# EAGLE schematic AM3352-TI (EAGLE 9.6.2), part 1 of 2
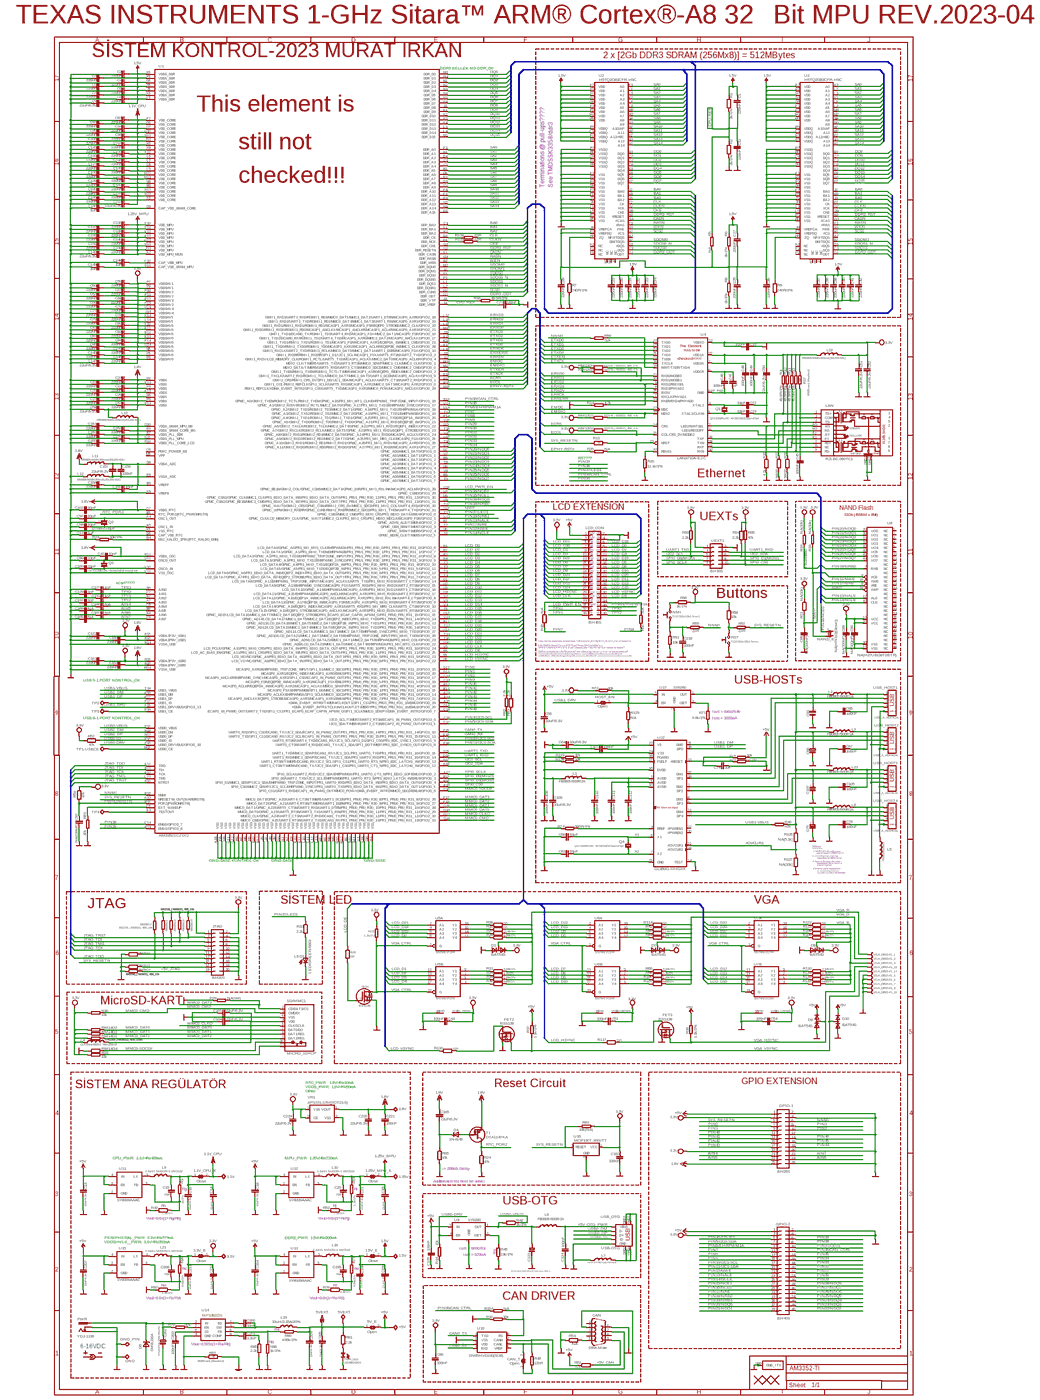
[diagram p0: schematic, sheet 1, overview]
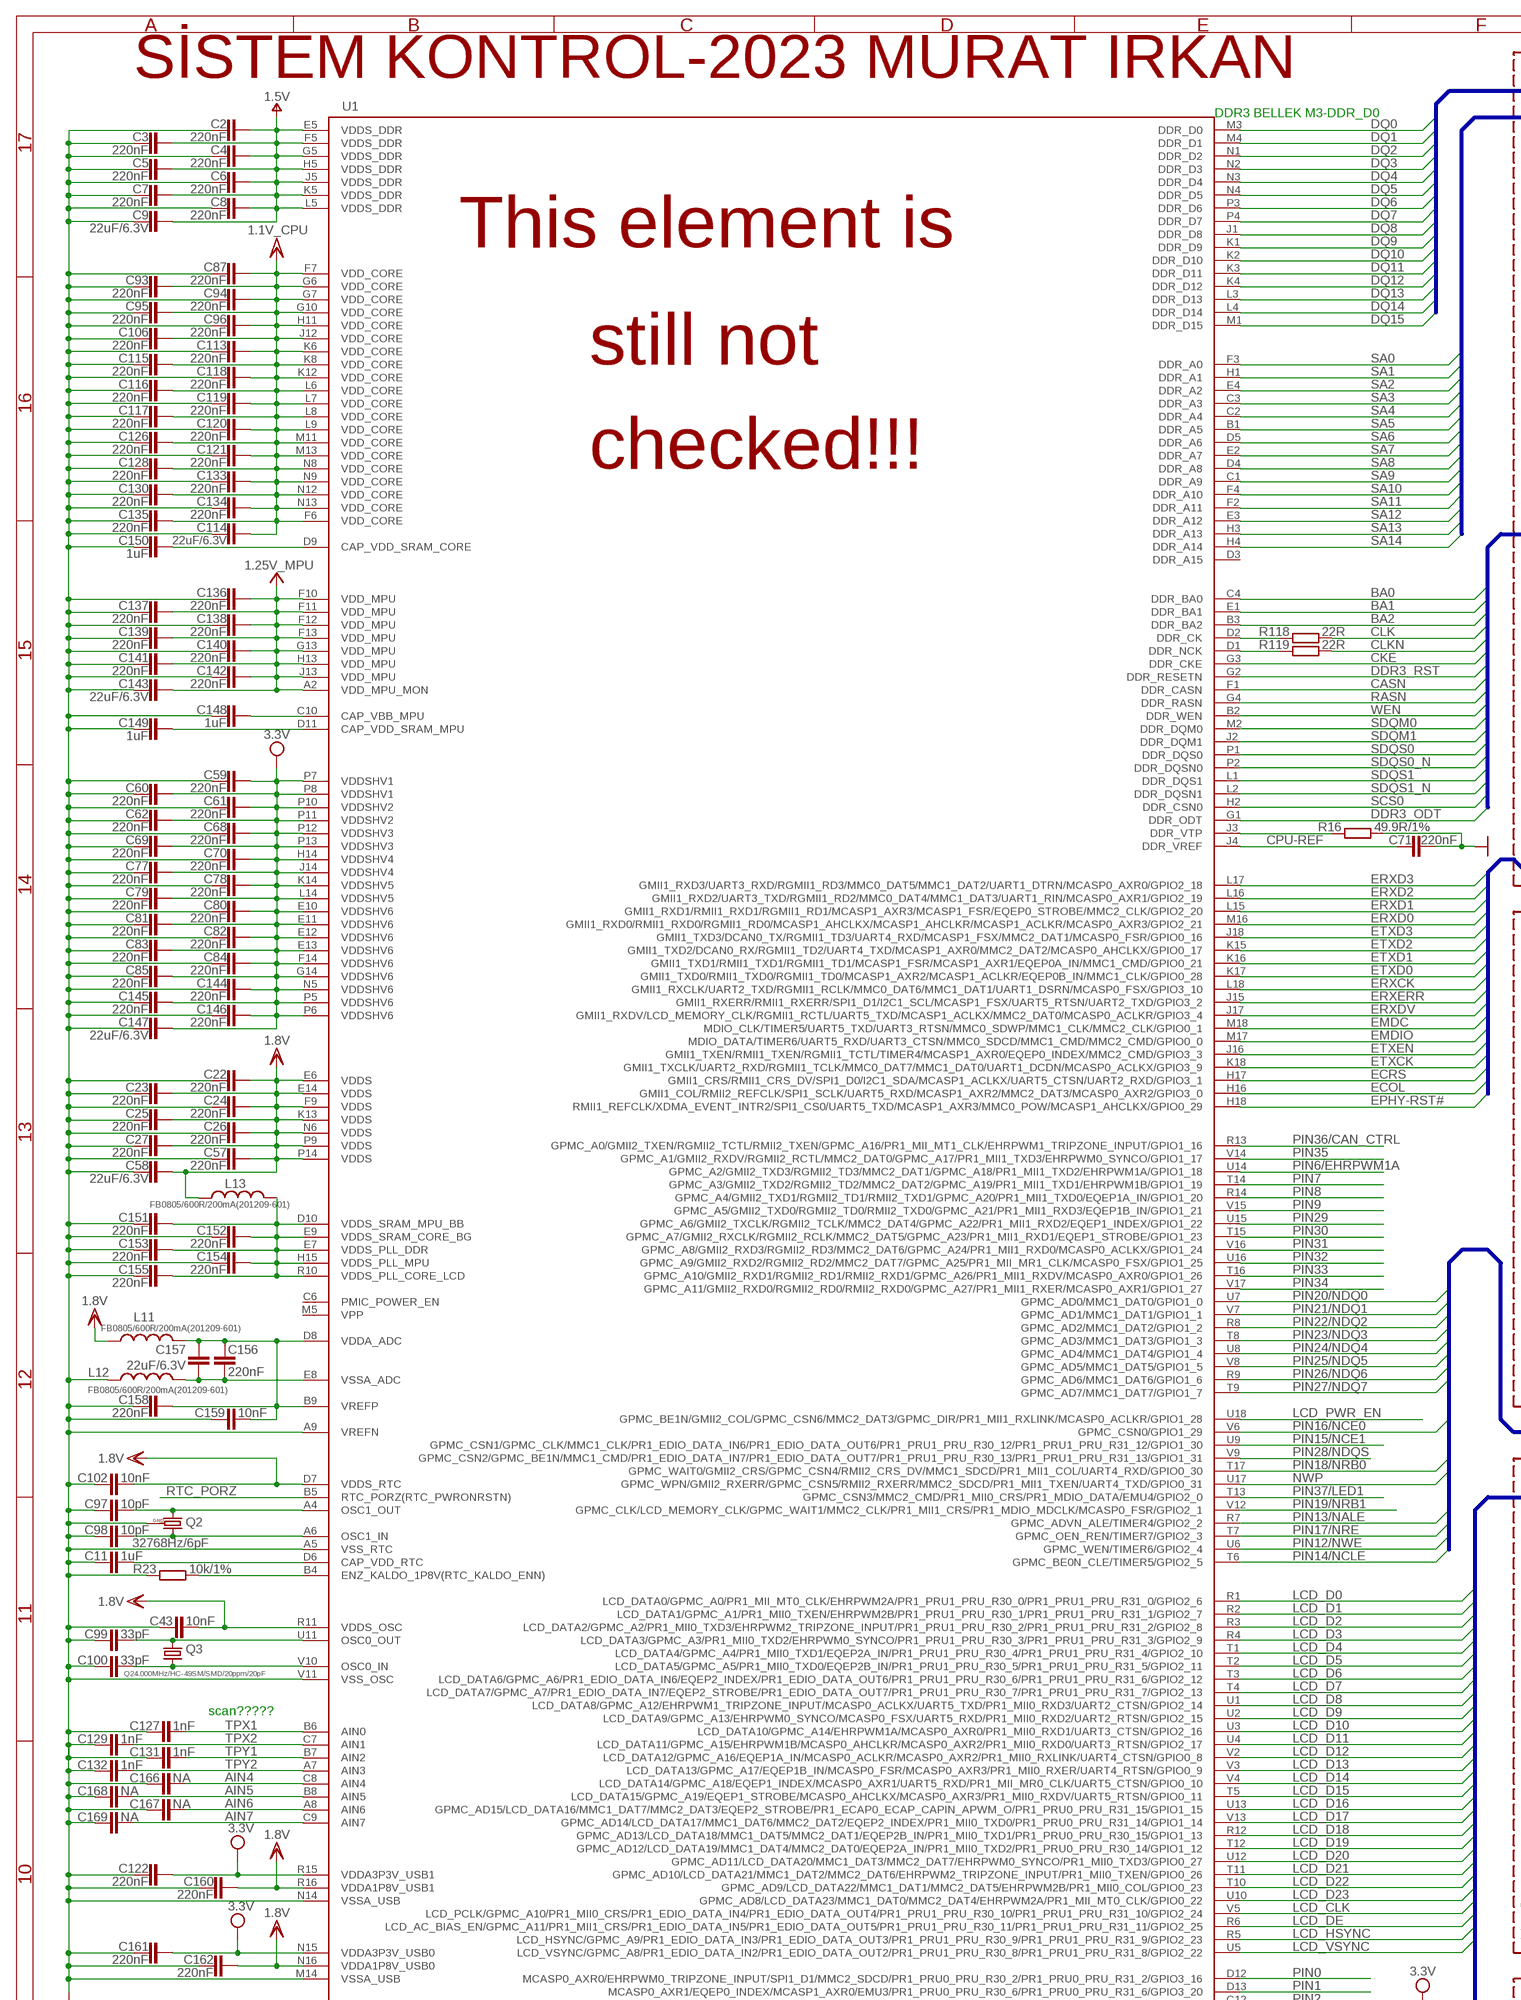
[diagram p1: schematic, sheet 1, part 1 of 4]
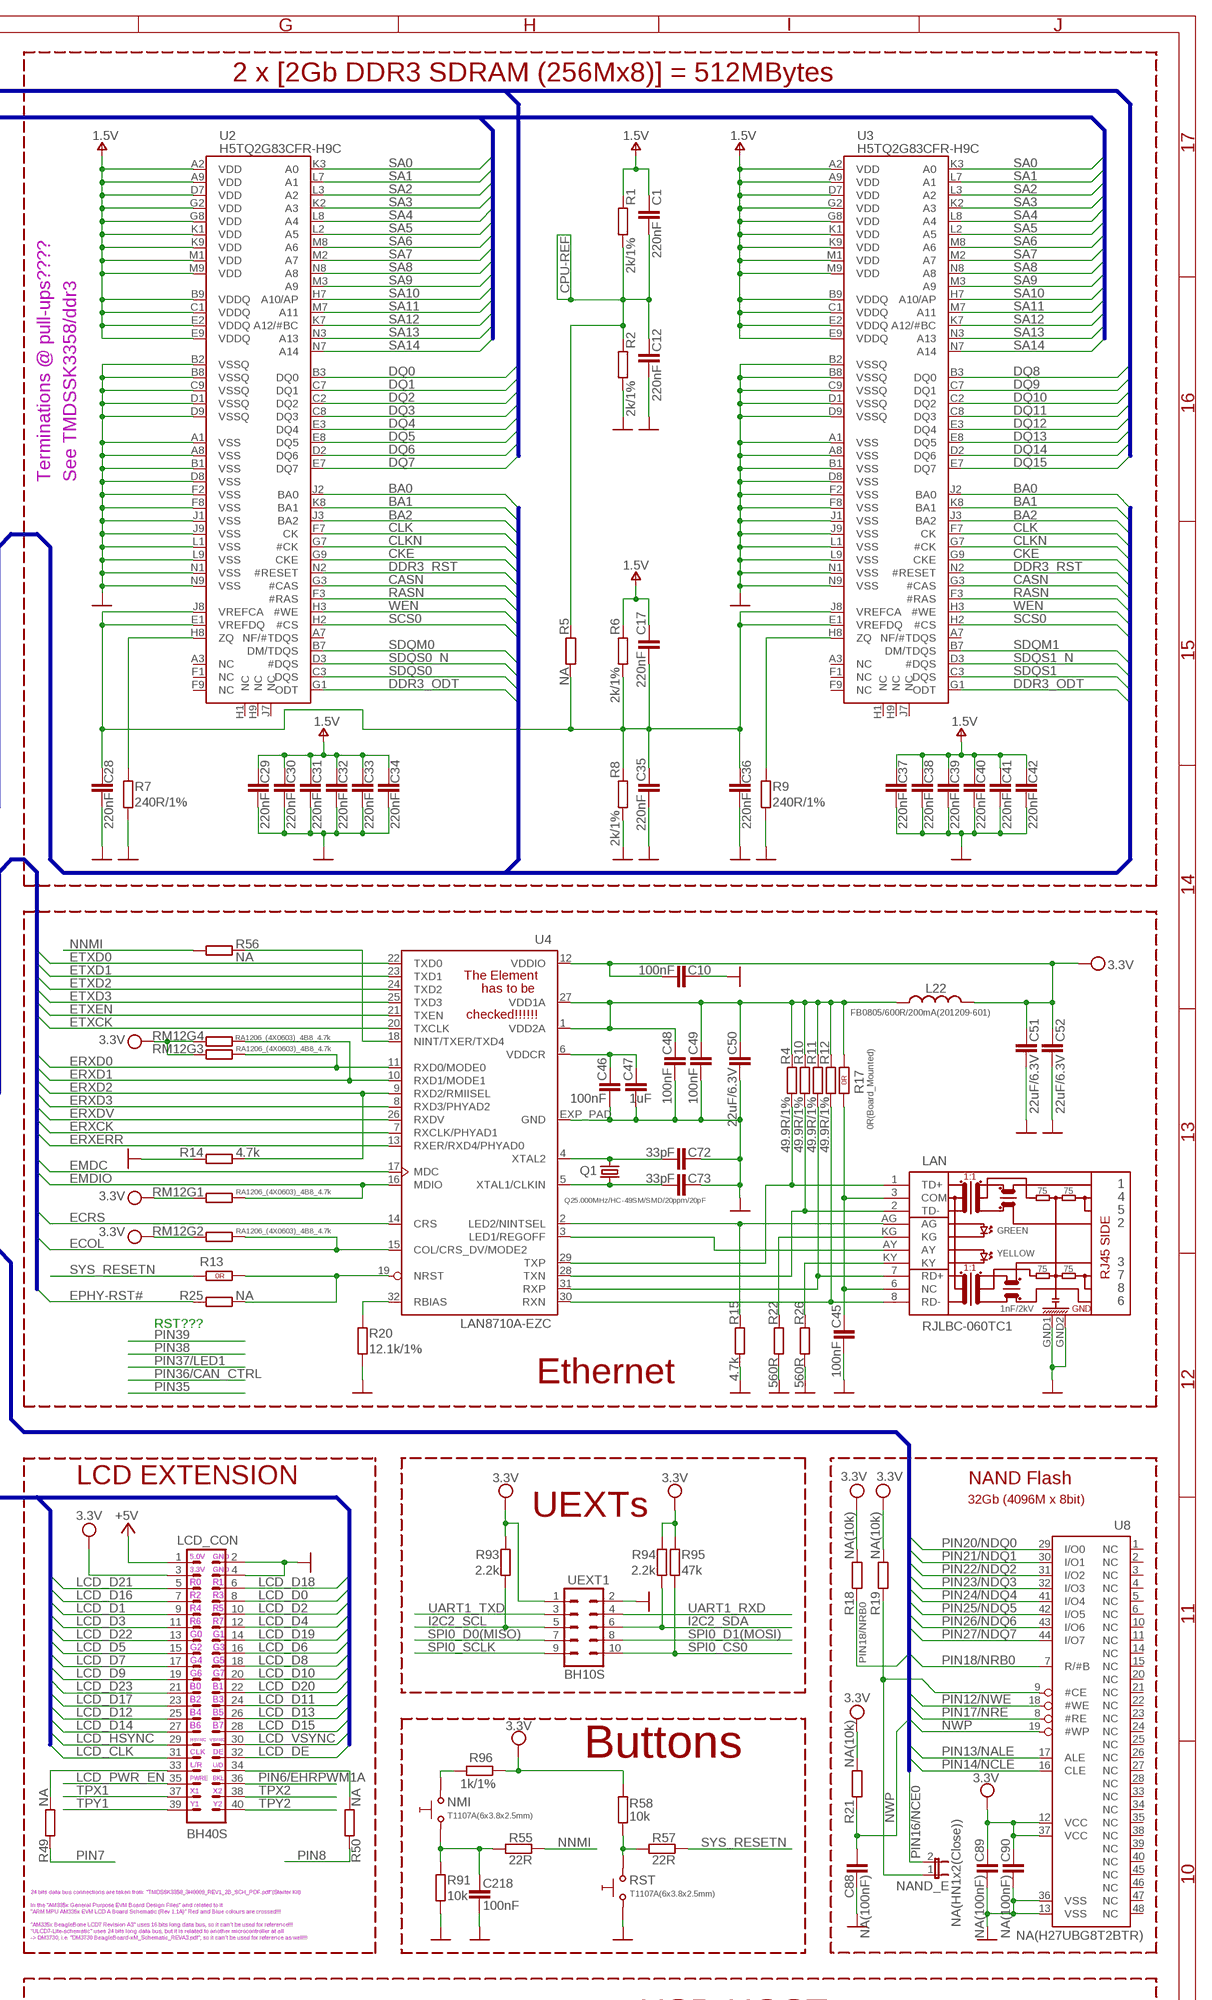
[diagram p2: schematic, sheet 1, part 2 of 4]
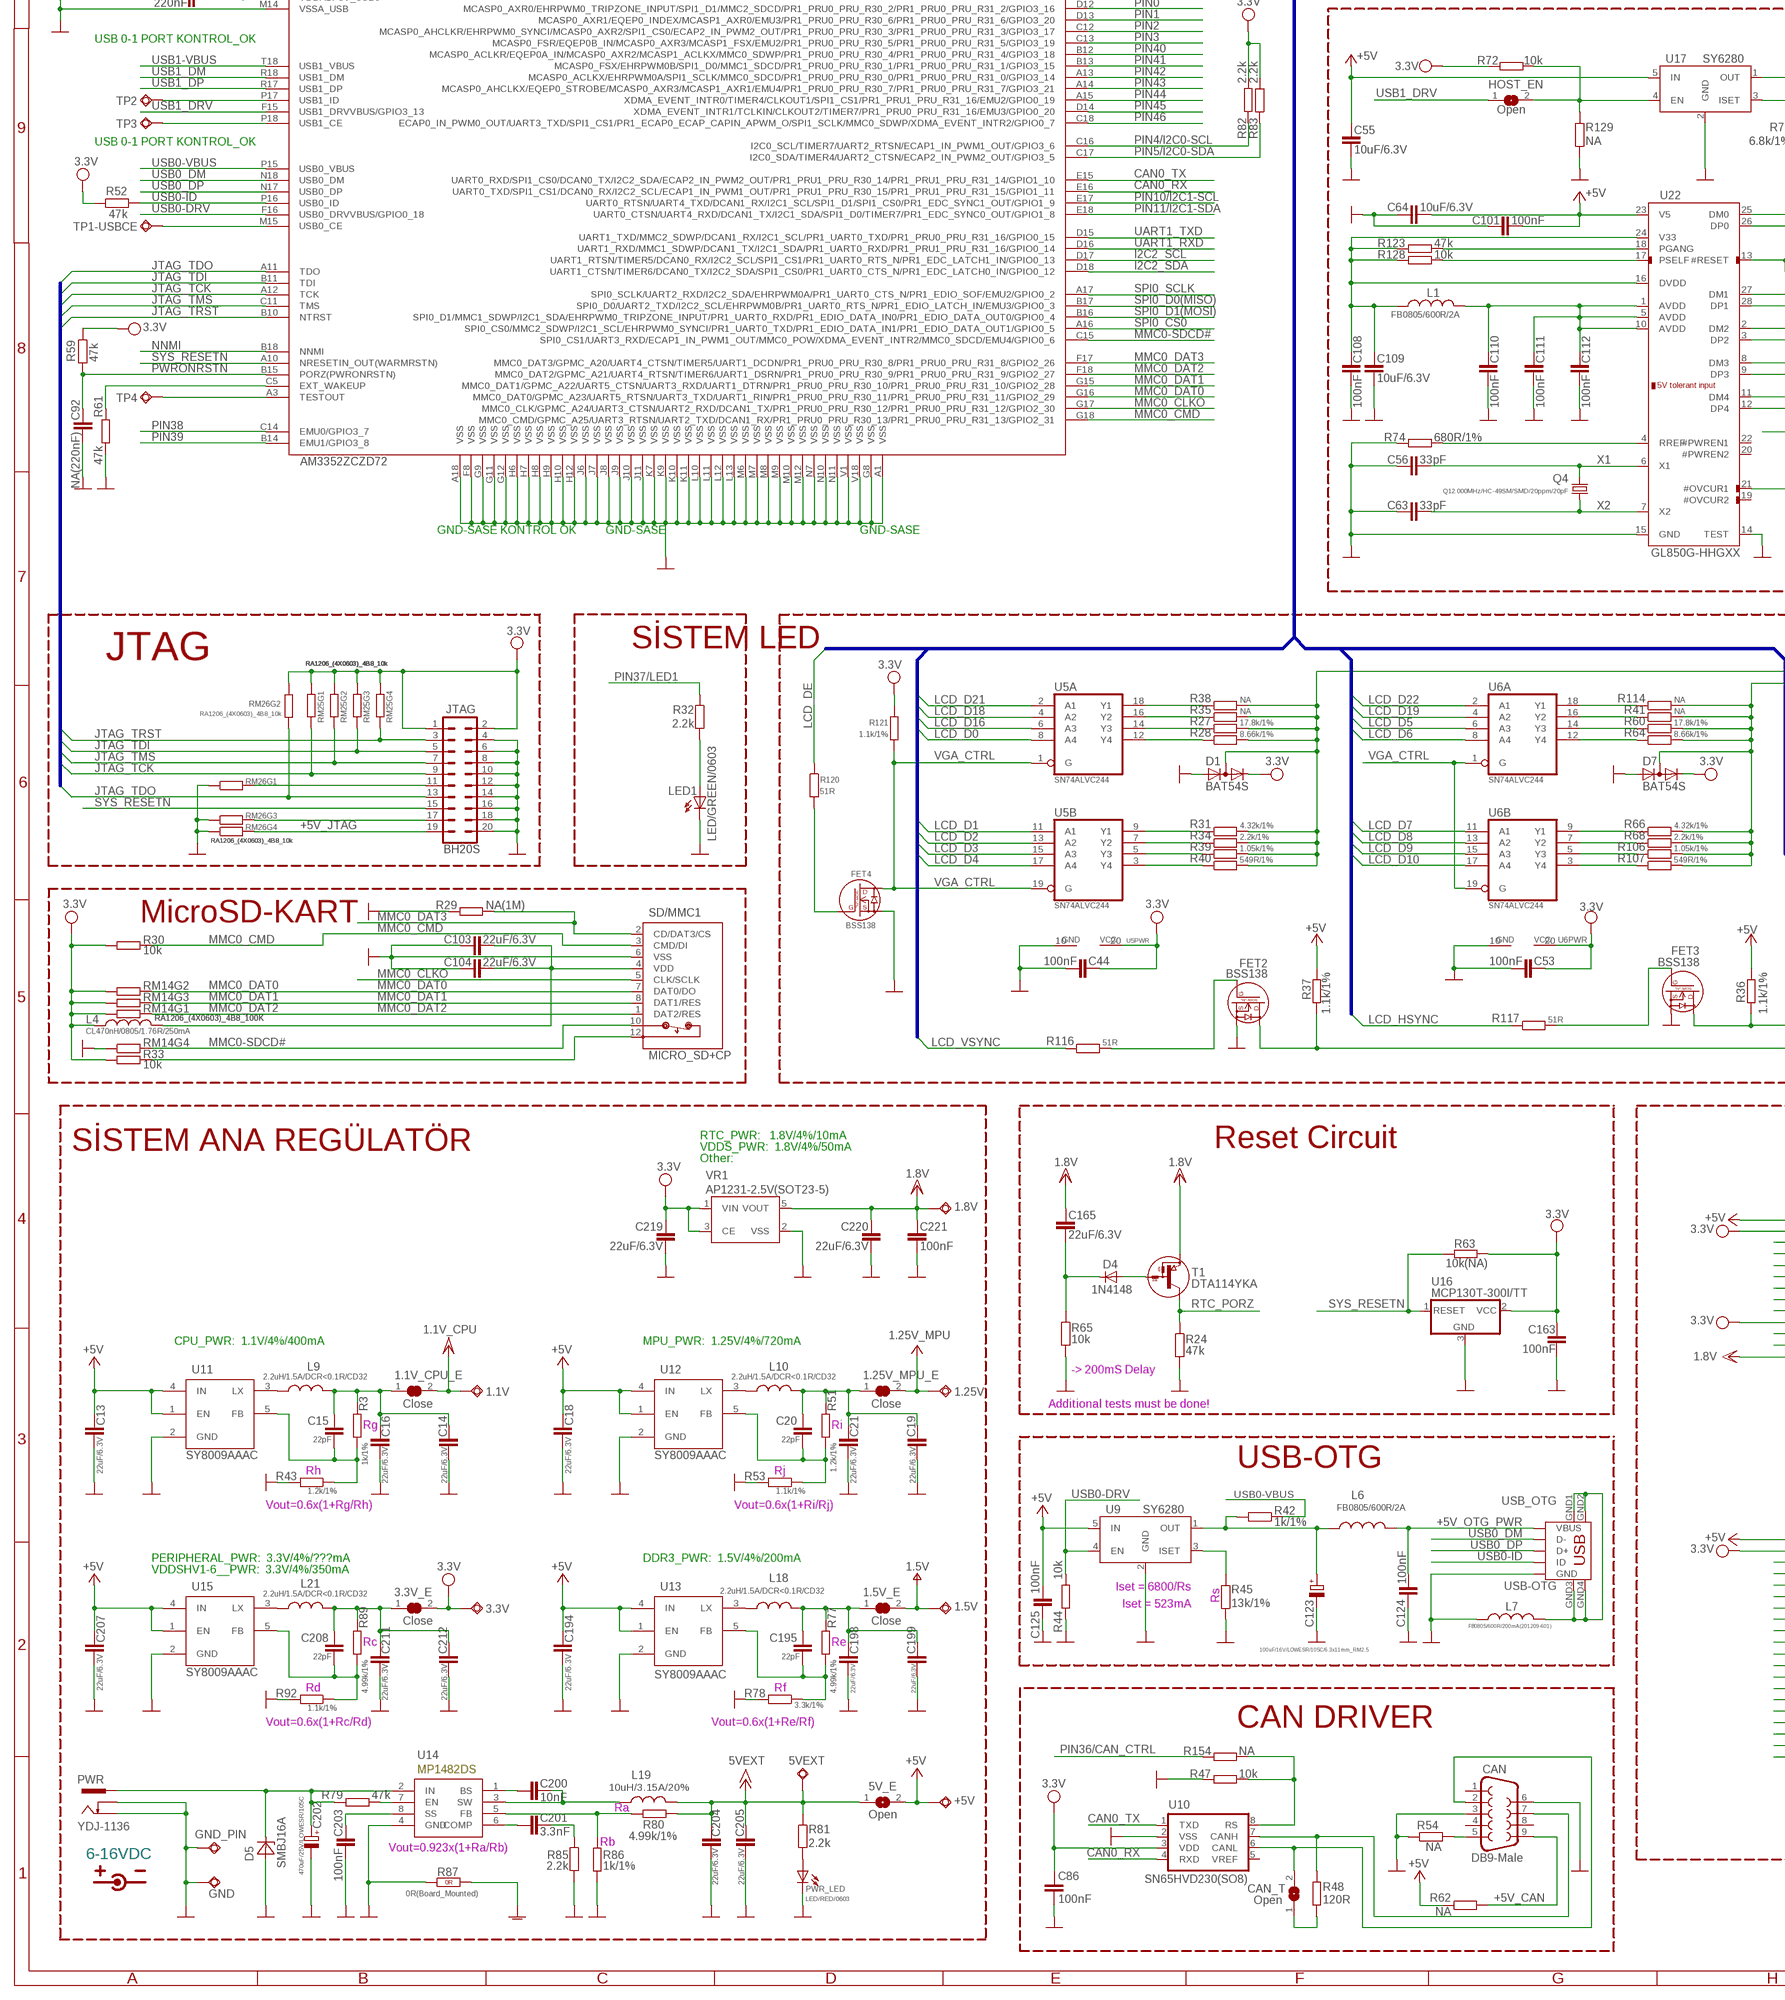
[diagram p3: schematic, sheet 1, part 3 of 4]
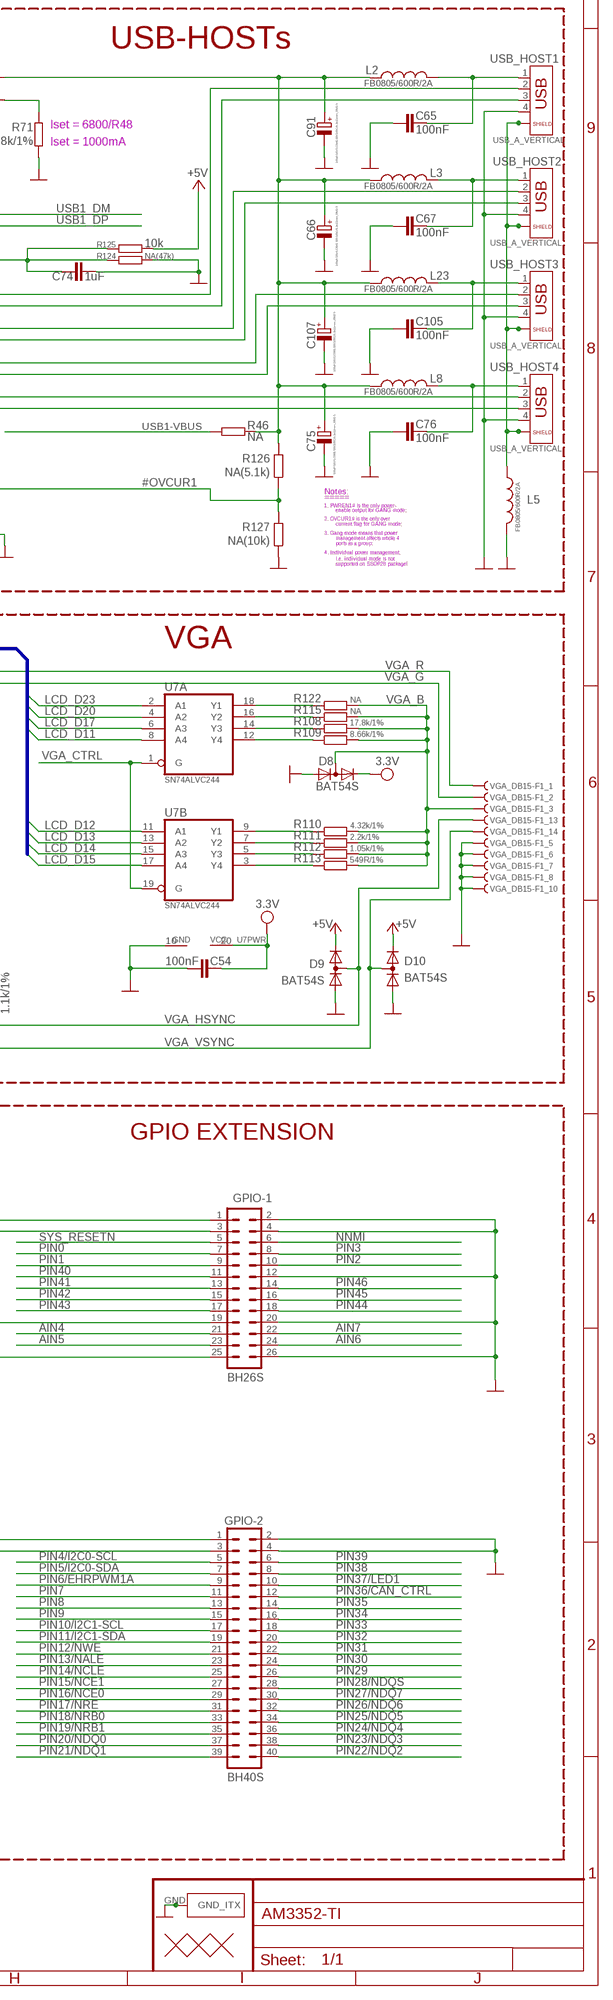
[diagram p4: schematic, sheet 1, part 4 of 4]

## Parts
1.1V  TESTPADTESTPAD_40-ROUND  [TESTPAD_40-ROUND]
1.1V_CPU_E  Close  SJSJ_1_SMALLER_CLOSE  [SJ_1_SMALLER_CLOSE]
1.5V  TESTPADTESTPAD_40-ROUND  [TESTPAD_40-ROUND]
1.5V_E  Close  SJSJ_1_SMALLER_CLOSE  [SJ_1_SMALLER_CLOSE]
1.8V  TESTPADTESTPAD_40-ROUND  [TESTPAD_40-ROUND]
1.25V  TESTPADTESTPAD_40-ROUND  [TESTPAD_40-ROUND]
1.25V_MPU_E  Close  SJSJ_1_SMALLER_CLOSE  [SJ_1_SMALLER_CLOSE]
3.3V  TESTPADTESTPAD_40-ROUND  [TESTPAD_40-ROUND]
3.3V_E  Close  SJSJ_1_SMALLER_CLOSE  [SJ_1_SMALLER_CLOSE]
5V_E  Open  SJSJ_SMALLER  [SJ_1_SMALLER]
5VEXT  TESTPADTESTPAD_40-ROUND  [TESTPAD_40-ROUND]
+5V  TESTPADTESTPAD_40-ROUND  [TESTPAD_40-ROUND]
C1  220nF  C-EUC0603_DWS  [C0603_DWS]
C2  220nF  C-EUC0603_DWS  [C0603_DWS]
C3  220nF  C-EUC0603_DWS  [C0603_DWS]
C4  220nF  C-EUC0603_DWS  [C0603_DWS]
C5  220nF  C-EUC0603_DWS  [C0603_DWS]
C6  220nF  C-EUC0603_DWS  [C0603_DWS]
C7  220nF  C-EUC0603_DWS  [C0603_DWS]
C8  220nF  C-EUC0603_DWS  [C0603_DWS]
C9  22uF/6.3V  C-EUC0603_DWS  [C0603_DWS]
C10  100nF  C-EUC0603_DWS  [C0603_DWS]
C11  1uF  C-EUC0603_DWS  [C0603_DWS]
C12  220nF  C-EUC0603_DWS  [C0603_DWS]
C13  22uF/6.3V  C-EUC0603_DWS  [C0603_DWS]
C14  22uF/6.3V  C-EUC0603_DWS  [C0603_DWS]
C15  22pF  C-EUC0603_DWS  [C0603_DWS]
C16  22uF/6.3V  C-EUC0603_DWS  [C0603_DWS]
C17  220nF  C-EUC0603_DWS  [C0603_DWS]
C18  22uF/6.3V  C-EUC0603_DWS  [C0603_DWS]
C19  22uF/6.3V  C-EUC0603_DWS  [C0603_DWS]
C20  22pF  C-EUC0603_DWS  [C0603_DWS]
C21  22uF/6.3V  C-EUC0603_DWS  [C0603_DWS]
C22  220nF  C-EUC0603_DWS  [C0603_DWS]
C23  220nF  C-EUC0603_DWS  [C0603_DWS]
C24  220nF  C-EUC0603_DWS  [C0603_DWS]
C25  220nF  C-EUC0603_DWS  [C0603_DWS]
C26  220nF  C-EUC0603_DWS  [C0603_DWS]
C27  220nF  C-EUC0603_DWS  [C0603_DWS]
C28  220nF  C-EUC0603_DWS  [C0603_DWS]
C29  220nF  C-EUC0603_DWS  [C0603_DWS]
C30  220nF  C-EUC0603_DWS  [C0603_DWS]
C31  220nF  C-EUC0603_DWS  [C0603_DWS]
C32  220nF  C-EUC0603_DWS  [C0603_DWS]
C33  220nF  C-EUC0603_DWS  [C0603_DWS]
C34  220nF  C-EUC0603_DWS  [C0603_DWS]
C35  220nF  C-EUC0603_DWS  [C0603_DWS]
C36  220nF  C-EUC0603_DWS  [C0603_DWS]
C37  220nF  C-EUC0603_DWS  [C0603_DWS]
C38  220nF  C-EUC0603_DWS  [C0603_DWS]
C39  220nF  C-EUC0603_DWS  [C0603_DWS]
C40  220nF  C-EUC0603_DWS  [C0603_DWS]
C41  220nF  C-EUC0603_DWS  [C0603_DWS]
C42  220nF  C-EUC0603_DWS  [C0603_DWS]
C43  10nF  C-EUC0603_DWS  [C0603_DWS]
C44  100nF  C-EUC0603_DWS  [C0603_DWS]
C45  100nF  C-EUC0603_DWS  [C0603_DWS]
C46  100nF  C-EUC0603_DWS  [C0603_DWS]
C47  1uF  C-EUC0603_DWS  [C0603_DWS]
C48  100nF  C-EUC0603_DWS  [C0603_DWS]
C49  100nF  C-EUC0603_DWS  [C0603_DWS]
C50  22uF/6.3V  C-EUC0603_DWS  [C0603_DWS]
C51  22uF/6.3V  C-EUC0603_DWS  [C0603_DWS]
C52  22uF/6.3V  C-EUC0603_DWS  [C0603_DWS]
C53  100nF  C-EUC0603_DWS  [C0603_DWS]
C54  100nF  C-EUC0603_DWS  [C0603_DWS]
C55  10uF/6.3V  C-EUC0603_DWS  [C0603_DWS]
C56  33pF  C-EUC0603_DWS  [C0603_DWS]
C57  220nF  C-EUC0603_DWS  [C0603_DWS]
C58  22uF/6.3V  C-EUC0603_DWS  [C0603_DWS]
C59  220nF  C-EUC0603_DWS  [C0603_DWS]
C60  220nF  C-EUC0603_DWS  [C0603_DWS]
C61  220nF  C-EUC0603_DWS  [C0603_DWS]
C62  220nF  C-EUC0603_DWS  [C0603_DWS]
C63  33pF  C-EUC0603_DWS  [C0603_DWS]
C64  10uF/6.3V  C-EUC0603_DWS  [C0603_DWS]
C65  100nF  C-EUC0603_DWS  [C0603_DWS]
C66  100uF/16V/LOWESR/105C/6.3x11mm_RM2.5  CPOL-EUE2.5-6.3  [E2,5-6,3]
C67  100nF  C-EUC0603_DWS  [C0603_DWS]
C68  220nF  C-EUC0603_DWS  [C0603_DWS]
C69  220nF  C-EUC0603_DWS  [C0603_DWS]
C70  220nF  C-EUC0603_DWS  [C0603_DWS]
C71  220nF  C-EUC0603_DWS  [C0603_DWS]
C72  33pF  C-EUC0603_DWS  [C0603_DWS]
C73  33pF  C-EUC0603_DWS  [C0603_DWS]
C74  1uF  C-EUC0603_DWS  [C0603_DWS]
C75  100uF/16V/LOWESR/105C/6.3x11mm_RM2.5  CPOL-EUE2.5-6.3  [E2,5-6,3]
C76  100nF  C-EUC0603_DWS  [C0603_DWS]
C77  220nF  C-EUC0603_DWS  [C0603_DWS]
C78  220nF  C-EUC0603_DWS  [C0603_DWS]
C79  220nF  C-EUC0603_DWS  [C0603_DWS]
C80  220nF  C-EUC0603_DWS  [C0603_DWS]
C81  220nF  C-EUC0603_DWS  [C0603_DWS]
C82  220nF  C-EUC0603_DWS  [C0603_DWS]
C83  220nF  C-EUC0603_DWS  [C0603_DWS]
C84  220nF  C-EUC0603_DWS  [C0603_DWS]
C85  220nF  C-EUC0603_DWS  [C0603_DWS]
C86  100nF  C-EUC0603_DWS  [C0603_DWS]
C87  220nF  C-EUC0603_DWS  [C0603_DWS]
C88  NA(100nF)  C-EUC0603_DWS  [C0603_DWS]
C89  NA(100nF)  C-EUC0603_DWS  [C0603_DWS]
C90  NA(100nF)  C-EUC0603_DWS  [C0603_DWS]
C91  100uF/16V/LOWESR/105C/6.3x11mm_RM2.5  CPOL-EUE2.5-6.3  [E2,5-6,3]
C92  NA(220nF)  C-EUC0603_DWS  [C0603_DWS]
C93  220nF  C-EUC0603_DWS  [C0603_DWS]
C94  220nF  C-EUC0603_DWS  [C0603_DWS]
C95  220nF  C-EUC0603_DWS  [C0603_DWS]
C96  220nF  C-EUC0603_DWS  [C0603_DWS]
C97  10pF  C-EUC0603_DWS  [C0603_DWS]
C98  10pF  C-EUC0603_DWS  [C0603_DWS]
C99  33pF  C-EUC0603_DWS  [C0603_DWS]
C100  33pF  C-EUC0603_DWS  [C0603_DWS]
C101  100nF  C-EUC0603_DWS  [C0603_DWS]
C102  10nF  C-EUC0603_DWS  [C0603_DWS]
C103  22uF/6.3V  C-EUC0603_DWS  [C0603_DWS]
C104  22uF/6.3V  C-EUC0603_DWS  [C0603_DWS]
C105  100nF  C-EUC0603_DWS  [C0603_DWS]
C106  220nF  C-EUC0603_DWS  [C0603_DWS]
C107  100uF/16V/LOWESR/105C/6.3x11mm_RM2.5  CPOL-EUE2.5-6.3  [E2,5-6,3]
C108  100nF  C-EUC0603_DWS  [C0603_DWS]
C109  10uF/6.3V  C-EUC0603_DWS  [C0603_DWS]
C110  100nF  C-EUC0603_DWS  [C0603_DWS]
C111  100nF  C-EUC0603_DWS  [C0603_DWS]
C112  100nF  C-EUC0603_DWS  [C0603_DWS]
C113  220nF  C-EUC0603_DWS  [C0603_DWS]
C114  22uF/6.3V  C-EUC0603_DWS  [C0603_DWS]
C115  220nF  C-EUC0603_DWS  [C0603_DWS]
C116  220nF  C-EUC0603_DWS  [C0603_DWS]
C117  220nF  C-EUC0603_DWS  [C0603_DWS]
C118  220nF  C-EUC0603_DWS  [C0603_DWS]
C119  220nF  C-EUC0603_DWS  [C0603_DWS]
C120  220nF  C-EUC0603_DWS  [C0603_DWS]
C121  220nF  C-EUC0603_DWS  [C0603_DWS]
C122  220nF  C-EUC0603_DWS  [C0603_DWS]
C123  100uF/16V/LOWESR/105C/6.3x11mm_RM2.5  CPOL-EUE2.5-6.3  [E2,5-6,3]
C124  100nF  C-EUC0603_DWS  [C0603_DWS]
C125  100nF  C-EUC0603_DWS  [C0603_DWS]
C126  220nF  C-EUC0603_DWS  [C0603_DWS]
C127  1nF  C-EUC0603_DWS  [C0603_DWS]
C128  220nF  C-EUC0603_DWS  [C0603_DWS]
C129  1nF  C-EUC0603_DWS  [C0603_DWS]
C130  220nF  C-EUC0603_DWS  [C0603_DWS]
C131  1nF  C-EUC0603_DWS  [C0603_DWS]
C132  1nF  C-EUC0603_DWS  [C0603_DWS]
C133  220nF  C-EUC0603_DWS  [C0603_DWS]
C134  220nF  C-EUC0603_DWS  [C0603_DWS]
C135  220nF  C-EUC0603_DWS  [C0603_DWS]
C136  220nF  C-EUC0603_DWS  [C0603_DWS]
C137  220nF  C-EUC0603_DWS  [C0603_DWS]
C138  220nF  C-EUC0603_DWS  [C0603_DWS]
C139  220nF  C-EUC0603_DWS  [C0603_DWS]
C140  220nF  C-EUC0603_DWS  [C0603_DWS]
C141  220nF  C-EUC0603_DWS  [C0603_DWS]
C142  220nF  C-EUC0603_DWS  [C0603_DWS]
C143  22uF/6.3V  C-EUC0603_DWS  [C0603_DWS]
C144  220nF  C-EUC0603_DWS  [C0603_DWS]
C145  220nF  C-EUC0603_DWS  [C0603_DWS]
C146  220nF  C-EUC0603_DWS  [C0603_DWS]
C147  22uF/6.3V  C-EUC0603_DWS  [C0603_DWS]
C148  1uF  C-EUC0603_DWS  [C0603_DWS]
C149  1uF  C-EUC0603_DWS  [C0603_DWS]
C150  1uF  C-EUC0603_DWS  [C0603_DWS]
C151  220nF  C-EUC0603_DWS  [C0603_DWS]
C152  220nF  C-EUC0603_DWS  [C0603_DWS]
C153  220nF  C-EUC0603_DWS  [C0603_DWS]
C154  220nF  C-EUC0603_DWS  [C0603_DWS]
C155  220nF  C-EUC0603_DWS  [C0603_DWS]
C156  220nF  C-EUC0603_DWS  [C0603_DWS]
C157  22uF/6.3V  C-EUC0603_DWS  [C0603_DWS]
C158  220nF  C-EUC0603_DWS  [C0603_DWS]
C159  10nF  C-EUC0603_DWS  [C0603_DWS]
C160  220nF  C-EUC0603_DWS  [C0603_DWS]
C161  220nF  C-EUC0603_DWS  [C0603_DWS]
C162  220nF  C-EUC0603_DWS  [C0603_DWS]
C163  100nF  C-EUC0603_DWS  [C0603_DWS]
C165  22uF/6.3V  C-EUC0603_DWS  [C0603_DWS]
C166  NA  C-EUC0603_DWS  [C0603_DWS]
C167  NA  C-EUC0603_DWS  [C0603_DWS]
C168  NA  C-EUC0603_DWS  [C0603_DWS]
C169  NA  C-EUC0603_DWS  [C0603_DWS]
C194  22uF/6.3V  C-EUC0603_DWS  [C0603_DWS]
C195  22pF  C-EUC0603_DWS  [C0603_DWS]
C198  22uF/6.3V  C-EUC0603_DWS  [C0603_DWS]
C199  22uF/6.3V  C-EUC0603_DWS  [C0603_DWS]
C200  10nF  C-EUC0603_DWS  [C0603_DWS]
C201  3.3nF  C-EUC0603_DWS  [C0603_DWS]
C202  470uF/25V/LOWESR/105C  CPOL-EUE5-10.5  [E5-10,5]
C203  100nF  C-EUC0603_DWS  [C0603_DWS]
C204  22uF/6.3V  C-EUC0603_DWS  [C0603_DWS]
C205  22uF/6.3V  C-EUC0603_DWS  [C0603_DWS]
C207  22uF/6.3V  C-EUC0603_DWS  [C0603_DWS]
C208  22pF  C-EUC0603_DWS  [C0603_DWS]
C211  22uF/6.3V  C-EUC0603_DWS  [C0603_DWS]
C212  22uF/6.3V  C-EUC0603_DWS  [C0603_DWS]
C218  100nF  C-EUC0603_DWS  [C0603_DWS]
C219  22uF/6.3V  C-EUC0603_DWS  [C0603_DWS]
C220  22uF/6.3V  C-EUC0603_DWS  [C0603_DWS]
C221  100nF  C-EUC0603_DWS  [C0603_DWS]
CAN  DB9-Male  F09  [F09HP-MALE]
CAN_T  Open  SJ  [SJ]
D1  BAT54S  DIODE_AC-AC_  [SOT23C(BAT54S)]
D4  1N4148  D-MLL-41  [MELF-MLL41]
D5  SMBJ16A  [DO214AA]
D7  BAT54S  DIODE_AC-AC_  [SOT23C(BAT54S)]
D8  BAT54S  DIODE_AC-AC_  [SOT23C(BAT54S)]
D9  BAT54S  DIODE_AC-AC_  [SOT23C(BAT54S)]
D10  BAT54S  DIODE_AC-AC_  [SOT23C(BAT54S)]
FET2  BSS138  N-MOS+DIODBSS138(SOT23-3)  [SOT23]
FET3  BSS138  N-MOS+DIODBSS138(SOT23-3)  [SOT23]
FET4  BSS138  N-MOS+DIODBSS138(SOT23-3)  [SOT23]
GND  TESTPADTESTPAD_40-ROUND  [TESTPAD_40-ROUND]
GND_PIN  TESTPAD3  [TEST_PAD40/70/SQUARE]
GPIO-1  BH26S  ML26  [ML26]
GPIO-2  BH40S  ML40  [ML40]
HOST_EN  Open  SJSJ_SMALLER  [SJ_1_SMALLER]
JTAG  BH20S  ML20  [ML20-MALE]
L1  FB0805/600R/2A  L-USL0805_5MIL_DWS  [L0805_5MIL_DWS]
L2  FB0805/600R/2A  L-USL0805_5MIL_DWS  [L0805_5MIL_DWS]
L3  FB0805/600R/2A  L-USL0805_5MIL_DWS  [L0805_5MIL_DWS]
L4  CL470nH/0805/1.76R/250mA  L-USL0805_5MIL_DWS  [L0805_5MIL_DWS]
L5  FB0805/600R/2A  L-USL0805_5MIL_DWS  [L0805_5MIL_DWS]
L6  FB0805/600R/2A  L-USL0805_5MIL_DWS  [L0805_5MIL_DWS]
L7  FB0805/600R/200mA(201209-601)  L-USL0805_5MIL_DWS  [L0805_5MIL_DWS]
L8  FB0805/600R/2A  L-USL0805_5MIL_DWS  [L0805_5MIL_DWS]
L9  2.2uH/1.5A/DCR<0.1R/CD32  L-CD32  [CD32]
L10  2.2uH/1.5A/DCR<0.1R/CD32  L-CD32  [CD32]
L11  FB0805/600R/200mA(201209-601)  L-USL0805_5MIL_DWS  [L0805_5MIL_DWS]
L12  FB0805/600R/200mA(201209-601)  L-USL0805_5MIL_DWS  [L0805_5MIL_DWS]
L13  FB0805/600R/200mA(201209-601)  L-USL0805_5MIL_DWS  [L0805_5MIL_DWS]
L18  2.2uH/1.5A/DCR<0.1R/CD32  L-CD32  [CD32]
L19  10uH/3.15A/20%  LLQH88PN100M38  [8X8MM_3131]
L21  2.2uH/1.5A/DCR<0.1R/CD32  L-CD32  [CD32]
L22  FB0805/600R/200mA(201209-601)  L-USL0805_5MIL_DWS  [L0805_5MIL_DWS]
L23  FB0805/600R/2A  L-USL0805_5MIL_DWS  [L0805_5MIL_DWS]
LAN  RJLBC-060TC1  RJLBC-060TC1_GND  [RJLBC-060TC1]
LCD_CON  BH40S  ML40  [ML40]
LED1  LED/GREEN/0603  LED0603DWS  [LED-0603]
NAND_E  NA(HN1x2(Close))  JP1E  [JP1]
NMI  T1107A(6x3.8x2.5mm)  SW-TAKT6  [SW-TAKT_6X3.5_SMD]
PWR  YDJ-1136  PWR-JAKPWR_JACK_UNI_MILLING  [PWR_JACK_UNI_MILLING]
PWR_LED  LED/RED/0603  LED0603DWS  [LED-0603]
Q1  Q25.000MHz/HC-49SM/SMD/20ppm/20pF  HC49/S1  [HC49/SMD2_THIN]
Q2  32768Hz/6pF  Q_GND1  [TC26H_3_REPAIR_SMD]
Q3  Q24.000MHz/HC-49SM/SMD/20ppm/20pF  HC49/S1  [HC49/SMD2_THIN]
Q4  Q12.000MHz/HC-49SM/SMD/20ppm/20pF  HC49/S1  [HC49/SMD2_THIN]
R1  2k/1%  R-EU_R0603_5MIL_DWS  [R0603_5MIL_DWS]
R2  2k/1%  R-EU_R0603_5MIL_DWS  [R0603_5MIL_DWS]
R3  1k/1%  R-EU_R0603_5MIL_DWS  [R0603_5MIL_DWS]
R4  49.9R/1%  R-EU_R0603_5MIL_DWS  [R0603_5MIL_DWS]
R5  NA  R-EU_R0603_5MIL_DWS  [R0603_5MIL_DWS]
R6  2k/1%  R-EU_R0603_5MIL_DWS  [R0603_5MIL_DWS]
R7  240R/1%  R-EU_R0603_5MIL_DWS  [R0603_5MIL_DWS]
R8  2k/1%  R-EU_R0603_5MIL_DWS  [R0603_5MIL_DWS]
R9  240R/1%  R-EU_R0603_5MIL_DWS  [R0603_5MIL_DWS]
R10  49.9R/1%  R-EU_R0603_5MIL_DWS  [R0603_5MIL_DWS]
R11  49.9R/1%  R-EU_R0603_5MIL_DWS  [R0603_5MIL_DWS]
R12  49.9R/1%  R-EU_R0603_5MIL_DWS  [R0603_5MIL_DWS]
R13  R_0R0R(NA)  [0603_0R]
R14  4.7k  R-EU_R0603_5MIL_DWS  [R0603_5MIL_DWS]
R15  4.7k  R-EU_R0603_5MIL_DWS  [R0603_5MIL_DWS]
R16  49.9R/1%  R-EU_R0603_5MIL_DWS  [R0603_5MIL_DWS]
R17  0R(Board_Mounted)  R_0R0R(NA)  [0603_0R]
R18  NA(10k)  R-EU_R0603_5MIL_DWS  [R0603_5MIL_DWS]
R19  NA(10k)  R-EU_R0603_5MIL_DWS  [R0603_5MIL_DWS]
R20  12.1k/1%  R-EU_R0603_5MIL_DWS  [R0603_5MIL_DWS]
R21  NA(10k)  R-EU_R0603_5MIL_DWS  [R0603_5MIL_DWS]
R22  560R  R-EU_R0603_5MIL_DWS  [R0603_5MIL_DWS]
R23  10k/1%  R-EU_R0603_5MIL_DWS  [R0603_5MIL_DWS]
R24  47k  R-EU_R0603_5MIL_DWS  [R0603_5MIL_DWS]
R25  NA  R-EU_R0603_5MIL_DWS  [R0603_5MIL_DWS]
R26  560R  R-EU_R0603_5MIL_DWS  [R0603_5MIL_DWS]
R27  17.8k/1%  R-EU_R0603_5MIL_DWS  [R0603_5MIL_DWS]
R28  8.66k/1%  R-EU_R0603_5MIL_DWS  [R0603_5MIL_DWS]
R29  NA(1M)  R-EU_R0603_5MIL_DWS  [R0603_5MIL_DWS]
R30  10k  R-EU_R0603_5MIL_DWS  [R0603_5MIL_DWS]
R31  4.32k/1%  R-EU_R0603_5MIL_DWS  [R0603_5MIL_DWS]
R32  2.2k  R-EU_R0603_5MIL_DWS  [R0603_5MIL_DWS]
R33  10k  R-EU_R0603_5MIL_DWS  [R0603_5MIL_DWS]
R34  2.2k/1%  R-EU_R0603_5MIL_DWS  [R0603_5MIL_DWS]
R35  NA  R-EU_R0603_5MIL_DWS  [R0603_5MIL_DWS]
R36  1.1k/1%  R-EU_R0603_5MIL_DWS  [R0603_5MIL_DWS]
R37  1.1k/1%  R-EU_R0603_5MIL_DWS  [R0603_5MIL_DWS]
R38  NA  R-EU_R0603_5MIL_DWS  [R0603_5MIL_DWS]
R39  1.05k/1%  R-EU_R0603_5MIL_DWS  [R0603_5MIL_DWS]
R40  549R/1%  R-EU_R0603_5MIL_DWS  [R0603_5MIL_DWS]
R41  NA  R-EU_R0603_5MIL_DWS  [R0603_5MIL_DWS]
R42  1k/1%  R-EU_R0603_5MIL_DWS  [R0603_5MIL_DWS]
R43  1.2k/1%  R-EU_R0603_5MIL_DWS  [R0603_5MIL_DWS]
R44  10k  R-EU_R0603_5MIL_DWS  [R0603_5MIL_DWS]
R45  13k/1%  R-EU_R0603_5MIL_DWS  [R0603_5MIL_DWS]
R46  NA  R-EU_R0603_5MIL_DWS  [R0603_5MIL_DWS]
R47  10k  R-EU_R0603_5MIL_DWS  [R0603_5MIL_DWS]
R48  120R  R-EU_R1206_5MIL_WS  [R1206_5MIL_WS]
R49  NA  R-EU_R0603_5MIL_DWS  [R0603_5MIL_DWS]
R50  NA  R-EU_R0603_5MIL_DWS  [R0603_5MIL_DWS]
R51  1.2k/1%  R-EU_R0603_5MIL_DWS  [R0603_5MIL_DWS]
R52  47k  R-EU_R0603_5MIL_DWS  [R0603_5MIL_DWS]
R53  1.1k/1%  R-EU_R0603_5MIL_DWS  [R0603_5MIL_DWS]
R54  NA  R-EU_R0603_5MIL_DWS_NA  [R0603_5MIL_DWS_NA]
R55  22R  R-EU_R0603_5MIL_DWS  [R0603_5MIL_DWS]
R56  NA  R-EU_R0603_5MIL_DWS  [R0603_5MIL_DWS]
R57  22R  R-EU_R0603_5MIL_DWS  [R0603_5MIL_DWS]
R58  10k  R-EU_R0603_5MIL_DWS  [R0603_5MIL_DWS]
R59  47k  R-EU_R0603_5MIL_DWS  [R0603_5MIL_DWS]
R60  17.8k/1%  R-EU_R0603_5MIL_DWS  [R0603_5MIL_DWS]
R61  47k  R-EU_R0603_5MIL_DWS  [R0603_5MIL_DWS]
R62  NA  R-EU_R0603_5MIL_DWS_NA  [R0603_5MIL_DWS_NA]
R63  10k(NA)  R-EU_R0603_5MIL_DWS  [R0603_5MIL_DWS]
R64  8.66k/1%  R-EU_R0603_5MIL_DWS  [R0603_5MIL_DWS]
R65  10k  R-EU_R0603_5MIL_DWS  [R0603_5MIL_DWS]
R66  4.32k/1%  R-EU_R0603_5MIL_DWS  [R0603_5MIL_DWS]
R68  2.2k/1%  R-EU_R0603_5MIL_DWS  [R0603_5MIL_DWS]
R71  6.8k/1%  R-EU_R0603_5MIL_DWS  [R0603_5MIL_DWS]
R72  10k  R-EU_R0603_5MIL_DWS  [R0603_5MIL_DWS]
R74  680R/1%  R-EU_R0603_5MIL_DWS  [R0603_5MIL_DWS]
R77  4.99k/1%  R-EU_R0603_5MIL_DWS  [R0603_5MIL_DWS]
R78  3.3k/1%  R-EU_R0603_5MIL_DWS  [R0603_5MIL_DWS]
R79  47k  R-EU_R0603_5MIL_DWS  [R0603_5MIL_DWS]
R80  4.99k/1%  R-EU_R0603_5MIL_DWS  [R0603_5MIL_DWS]
R81  2.2k  R-EU_R0603_5MIL_DWS  [R0603_5MIL_DWS]
R82  2.2k  R-EU_R0603_5MIL_DWS  [R0603_5MIL_DWS]
R83  2.2k  R-EU_R0603_5MIL_DWS  [R0603_5MIL_DWS]
R85  2.2k  R-EU_R0603_5MIL_DWS  [R0603_5MIL_DWS]
R86  1k/1%  R-EU_R0603_5MIL_DWS  [R0603_5MIL_DWS]
R87  0R(Board_Mounted)  R_0R0R(NA)  [0603_0R]
R89  4.99k/1%  R-EU_R0603_5MIL_DWS  [R0603_5MIL_DWS]
R91  10k  R-EU_R0603_5MIL_DWS  [R0603_5MIL_DWS]
R92  1.1k/1%  R-EU_R0603_5MIL_DWS  [R0603_5MIL_DWS]
R93  2.2k  R-EU_R0603_5MIL_DWS  [R0603_5MIL_DWS]
R94  2.2k  R-EU_R0603_5MIL_DWS  [R0603_5MIL_DWS]
R95  47k  R-EU_R0603_5MIL_DWS  [R0603_5MIL_DWS]
R96  1k/1%  R-EU_R0603_5MIL_DWS  [R0603_5MIL_DWS]
R106  1.05k/1%  R-EU_R0603_5MIL_DWS  [R0603_5MIL_DWS]
R107  549R/1%  R-EU_R0603_5MIL_DWS  [R0603_5MIL_DWS]
R108  17.8k/1%  R-EU_R0603_5MIL_DWS  [R0603_5MIL_DWS]
R109  8.66k/1%  R-EU_R0603_5MIL_DWS  [R0603_5MIL_DWS]
R110  4.32k/1%  R-EU_R0603_5MIL_DWS  [R0603_5MIL_DWS]
R111  2.2k/1%  R-EU_R0603_5MIL_DWS  [R0603_5MIL_DWS]
R112  1.05k/1%  R-EU_R0603_5MIL_DWS  [R0603_5MIL_DWS]
R113  549R/1%  R-EU_R0603_5MIL_DWS  [R0603_5MIL_DWS]
R114  NA  R-EU_R0603_5MIL_DWS  [R0603_5MIL_DWS]
R115  NA  R-EU_R0603_5MIL_DWS  [R0603_5MIL_DWS]
R116  51R  R-EU_R0603_5MIL_DWS  [R0603_5MIL_DWS]
R117  51R  R-EU_R0603_5MIL_DWS  [R0603_5MIL_DWS]
R118  22R  R-EU_R0603_5MIL_DWS  [R0603_5MIL_DWS]
R119  22R  R-EU_R0603_5MIL_DWS  [R0603_5MIL_DWS]
R120  51R  R-EU_R0603_5MIL_DWS  [R0603_5MIL_DWS]
R121  1.1k/1%  R-EU_R0603_5MIL_DWS  [R0603_5MIL_DWS]
R122  NA  R-EU_R0603_5MIL_DWS  [R0603_5MIL_DWS]
R123  47k  R-EU_R0603_5MIL_DWS  [R0603_5MIL_DWS]
R124  NA(47k)  R-EU_R0603_5MIL_DWS  [R0603_5MIL_DWS]
R125  10k  R-EU_R0603_5MIL_DWS  [R0603_5MIL_DWS]
R126  NA(5.1k)  R-EU_R0603_5MIL_DWS  [R0603_5MIL_DWS]
R127  NA(10k)  R-EU_R0603_5MIL_DWS  [R0603_5MIL_DWS]
R128  10k  R-EU_R0603_5MIL_DWS  [R0603_5MIL_DWS]
R129  NA  R-EU_R0603_5MIL_DWS  [R0603_5MIL_DWS]
R154  NA  R-EU_R0603_5MIL_DWS_NA  [R0603_5MIL_DWS_NA]
RM12  RA1206_(4X0603)_4B8_4.7k  R_MATRIX_4E  [R_MATRIX_4]
RM14  RA1206_(4X0603)_4B8_100K  R_MATRIX_4E  [R_MATRIX_4]
RM25  RA1206_(4X0603)_4B8_10k  R_MATRIX_4E  [R_MATRIX_4]
RM26  RA1206_(4X0603)_4B8_10k  R_MATRIX_4E  [R_MATRIX_4]
RST  T1107A(6x3.8x2.5mm)  SW-TAKT6  [SW-TAKT_6X3.5_SMD]
SD/MMC1  MICRO_SD+CP  MICRO_SD/MMC_CPMICRO  [TFR-MEM-CON]
T1  DTA114YKA  DIGITAL_TRANSISTORS-PNPDTA114YKA  [SOT-23]
TP1-USBCE  TESTPADTESTPAD_40-ROUND  [TESTPAD_40-ROUND]
TP2  TESTPADTESTPAD_40-ROUND  [TESTPAD_40-ROUND]
TP3  TESTPADTESTPAD_40-ROUND  [TESTPAD_40-ROUND]
TP4  TESTPADTESTPAD_40-ROUND  [TESTPAD_40-ROUND]
U1  AM3352ZCZD72  AM3352ZCZD72-(0.5MM_BALLLS)  [S-PBGA-N324]
U2  H5TQ2G83CFR-H9C  [FBGA78]
U3  H5TQ2G83CFR-H9C  [FBGA78]
U4  LAN8710A-EZC  [QFN-32]
U5  SN74ALVC244  74ALVC244  [PW]
U6  SN74ALVC244  74ALVC244  [PW]
U7  SN74ALVC244  74ALVC244  [PW]
U8  NA(H27UBG8T2BTR)  H27UBG8T2A  [TSOP48]
U9  SY6280  [SOT23-5]
U10  SN65HVD230(SO8)  MCP2551  [SO-08]
U11  SY8009AAAC  SY8008  [SOT23-5]
U12  SY8009AAAC  SY8008  [SOT23-5]
U13  SY8009AAAC  SY8008  [SOT23-5]
U14  MP1482DS  MP1482  [SOIC8]
U15  SY8009AAAC  SY8008  [SOT23-5]
U16  MCP130T-300I/TT  RESETMCP130T-300-I/TT  [SOT23]
U17  SY6280  [SOT23-5]
U19  FIDUCIAL1X2  [FIDUCIAL-1X2]
U20  FIDUCIAL1X2  [FIDUCIAL-1X2]
U21  FIDUCIAL1X2  [FIDUCIAL-1X2]
U22  GL850G-HHGXX  GL850G  [SSOP28]
U$1  NANO_ITX_  [NANO-ITX_140X140]
UEXT1  BH10S  ML10  [ML10-MALE]
USB_HOST1  USB_A_VERTICAL  USB_SHIELDUSB_A_VERTICAL  [USB_A_VERTICAL_PTH]
USB_HOST2  USB_A_VERTICAL  USB_SHIELDUSB_A_VERTICAL  [USB_A_VERTICAL_PTH]
USB_HOST3  USB_A_VERTICAL  USB_SHIELDUSB_A_VERTICAL  [USB_A_VERTICAL_PTH]
USB_HOST4  USB_A_VERTICAL  USB_SHIELDUSB_A_VERTICAL  [USB_A_VERTICAL_PTH]
USB_OTG  USB-OTG  MINI_USB9  [USB_MINI_9PIN]
VGA_DB15-F1  VGA15  DB1522  [DB15-F_22MM]
VR1  AP1231-2.5V(SOT23-5)  AP1231-33  [SOT-23-5]

## Nets
#OVCUR1: R126.1 R127.2 U22.21(#OVCUR1)
+5V: 5V_E.2 +5V.1(PP) C13.1 C18.1 C55.1 C64.1 C101.1 C125.1 C194.1 C207.1 D9.2(K) D10.2(K) GPIO-1.1 GPIO-2.1 LCD_CON.1 R36.2 R37.2 R62.1 R125.2 U9.5(IN) U11.1(EN) U11.4(IN) U12.1(EN) U12.4(IN) U13.1(EN) U13.4(IN) U15.1(EN) U15.4(IN) U17.5(IN) U22.23(V5)
+5V_CAN: CAN.9 R62.2
+5V_JTAG: JTAG.19 RM26.4.2
+5V_OTG_PWR: C124.1 L6.1 USB_OTG.VBUS
+15V: 5V_E.1 5VEXT.1(PP) C204.1 C205.1 L19.2 R80.2 R81.1 ; supply symbol labelled 5VEXT
AIN4: C166.2 GPIO-1.21 U1.C8(AIN4)
AIN5: C168.2 GPIO-1.23 U1.B8(AIN5)
AIN6: C167.2 GPIO-1.24 U1.A8(AIN6)
AIN7: C169.2 GPIO-1.22 U1.C9(AIN7)
AVDD1: C110.1 C111.1 C112.1 L1.2 U22.1(AVDD) U22.5(AVDD) U22.10(AVDD)
BA0: U1.C4(DDR_BA0) U2.J2(BA0) U3.J2(BA0)
BA1: U1.E1(DDR_BA1) U2.K8(BA1) U3.K8(BA1)
BA2: U1.B3(DDR_BA2) U2.J3(BA2) U3.J3(BA2)
CAN0_RX: U1.E16(UART0_TXD/SPI1_CS1/DCAN0_RX/I2C2_SCL/ECAP1_IN_PWM1_OUT/PR1_PRU1_PRU_R30_15/PR1_PRU1_PRU_R31_15/GPIO1_11) U10.4(RXD)
CAN0_TX: U1.E15(UART0_RXD/SPI1_CS0/DCAN0_TX/I2C2_SDA/ECAP2_IN_PWM2_OUT/PR1_PRU1_PRU_R30_14/PR1_PRU1_PRU_R31_14/GPIO1_10) U10.1(TXD)
CANH: CAN.7 R48.2 U10.7(CANH)
CANL: CAN.2 CAN_T.2 U10.6(CANL)
CASN: U1.F1(DDR_CASN) U2.G3(#CAS) U3.G3(#CAS)
CKE: U1.G3(DDR_CKE) U2.G9(CKE) U3.G9(CKE)
CLK: R118.1 U2.F7(CK) U3.F7(CK)
CLKN: R119.1 U2.G7(#CK) U3.G7(#CK)
CPU-REF: C1.2 C12.2 C71.2 R1.1 R2.2 R5.2 U1.J4(DDR_VREF)
DDR3_ODT: U1.G1(DDR_ODT) U2.G1(ODT) U3.G1(ODT)
DDR3_RST: U1.G2(DDR_RESETN) U2.N2(#RESET) U3.N2(#RESET)
DM1: U22.27(DM1) USB_HOST1.2
DM2: U22.2(DM2) USB_HOST2.2
DM3: U22.8(DM3) USB_HOST3.2
DM4: U22.11(DM4) USB_HOST4.2
DP1: U22.28(DP1) USB_HOST1.3
DP2: U22.3(DP2) USB_HOST2.3
DP3: U22.9(DP3) USB_HOST3.3
DP4: U22.12(DP4) USB_HOST4.3
DQ0: U1.M3(DDR_D0) U2.B3(DQ0)
DQ1: U1.M4(DDR_D1) U2.C7(DQ1)
DQ2: U1.N1(DDR_D2) U2.C2(DQ2)
DQ3: U1.N2(DDR_D3) U2.C8(DQ3)
DQ4: U1.N3(DDR_D4) U2.E3(DQ4)
DQ5: U1.N4(DDR_D5) U2.E8(DQ5)
DQ6: U1.P3(DDR_D6) U2.D2(DQ6)
DQ7: U1.P4(DDR_D7) U2.E7(DQ7)
DQ8: U1.J1(DDR_D8) U3.B3(DQ0)
DQ9: U1.K1(DDR_D9) U3.C7(DQ1)
DQ10: U1.K2(DDR_D10) U3.C2(DQ2)
DQ11: U1.K3(DDR_D11) U3.C8(DQ3)
DQ12: U1.K4(DDR_D12) U3.E3(DQ4)
DQ13: U1.L3(DDR_D13) U3.E8(DQ5)
DQ14: U1.L4(DDR_D14) U3.D2(DQ6)
DQ15: U1.M1(DDR_D15) U3.E7(DQ7)
DRAM-REF: C17.2 C28.2 C35.2 C36.2 R5.1 R6.1 R8.2 U2.E1(VREFDQ) U2.J8(VREFCA) U3.E1(VREFDQ) U3.J8(VREFCA)
DVDD1: C108.1 C109.1 L1.1 R123.1 R128.1 U22.16(DVDD) U22.24(V33)
ECOL: RM12.2.2 U1.H16(GMII1_COL/RMII2_REFCLK/SPI1_SCLK/UART5_RXD/MCASP1_AXR2/MMC2_DAT3/MCASP0_AXR2/GPIO3_0) U4.15(COL/CRS_DV/MODE2)
ECRS: U1.H17(GMII1_CRS/RMII1_CRS_DV/SPI1_D0/I2C1_SDA/MCASP1_ACLKX/UART5_CTSN/UART2_RXD/GPIO3_1) U4.14(CRS)
EMDC: U1.M18(MDIO_CLK/TIMER5/UART5_TXD/UART3_RTSN/MMC0_SDWP/MMC1_CLK/MMC2_CLK/GPIO0_1) U4.17(MDC)
EMDIO: RM12.1.2 U1.M17(MDIO_DATA/TIMER6/UART5_RXD/UART3_CTSN/MMC0_SDCD/MMC1_CMD/MMC2_CMD/GPIO0_0) U4.16(MDIO)
EPHY-RST#: R25.1 U1.H18(RMII1_REFCLK/XDMA_EVENT_INTR2/SPI1_CS0/UART5_TXD/MCASP1_AXR3/MMC0_POW/MCASP1_AHCLKX/GPIO0_29)
ERXCK: U1.L18(GMII1_RXCLK/UART2_TXD/RGMII1_RCLK/MMC0_DAT6/MMC1_DAT1/UART1_DSRN/MCASP0_FSX/GPIO3_10) U4.7(RXCLK/PHYAD1)
ERXD0: RM12.3.2 U1.M16(GMII1_RXD0/RMII1_RXD0/RGMII1_RD0/MCASP1_AHCLKX/MCASP1_AHCLKR/MCASP1_ACLKR/MCASP0_AXR3/GPIO2_21) U4.11(RXD0/MODE0)
ERXD1: RM12.4.2 U1.L15(GMII1_RXD1/RMII1_RXD1/RGMII1_RD1/MCASP1_AXR3/MCASP1_FSR/EQEP0_STROBE/MMC2_CLK/GPIO2_20) U4.10(RXD1/MODE1)
ERXD2: R14.2 U1.L16(GMII1_RXD2/UART3_TXD/RGMII1_RD2/MMC0_DAT4/MMC1_DAT3/UART1_RIN/MCASP0_AXR1/GPIO2_19) U4.9(RXD2/RMIISEL)
ERXD3: U1.L17(GMII1_RXD3/UART3_RXD/RGMII1_RD3/MMC0_DAT5/MMC1_DAT2/UART1_DTRN/MCASP0_AXR0/GPIO2_18) U4.8(RXD3/PHYAD2)
ERXDV: U1.J17(GMII1_RXDV/LCD_MEMORY_CLK/RGMII1_RCTL/UART5_TXD/MCASP1_ACLKX/MMC2_DAT0/MCASP0_ACLKR/GPIO3_4) U4.26(RXDV)
ERXERR: U1.J15(GMII1_RXERR/RMII1_RXERR/SPI1_D1/I2C1_SCL/MCASP1_FSX/UART5_RTSN/UART2_TXD/GPIO3_2) U4.13(RXER/RXD4/PHYAD0)
ETXCK: U1.K18(GMII1_TXCLK/UART2_RXD/RGMII1_TCLK/MMC0_DAT7/MMC1_DAT0/UART1_DCDN/MCASP0_ACLKX/GPIO3_9) U4.20(TXCLK)
ETXD0: U1.K17(GMII1_TXD0/RMII1_TXD0/RGMII1_TD0/MCASP1_AXR2/MCASP1_ACLKR/EQEP0B_IN/MMC1_CLK/GPIO0_28) U4.22(TXD0)
ETXD1: U1.K16(GMII1_TXD1/RMII1_TXD1/RGMII1_TD1/MCASP1_FSR/MCASP1_AXR1/EQEP0A_IN/MMC1_CMD/GPIO0_21) U4.23(TXD1)
ETXD2: U1.K15(GMII1_TXD2/DCAN0_RX/RGMII1_TD2/UART4_TXD/MCASP1_AXR0/MMC2_DAT2/MCASP0_AHCLKX/GPIO0_17) U4.24(TXD2)
ETXD3: U1.J18(GMII1_TXD3/DCAN0_TX/RGMII1_TD3/UART4_RXD/MCASP1_FSX/MMC2_DAT1/MCASP0_FSR/GPIO0_16) U4.25(TXD3)
ETXEN: U1.J16(GMII1_TXEN/RMII1_TXEN/RGMII1_TCTL/TIMER4/MCASP1_AXR0/EQEP0_INDEX/MMC2_CMD/GPIO3_3) U4.21(TXEN)
GND [PWR]: C2.1 C3.1 C4.1 C5.1 C6.1 C7.1 C8.1 C9.1 C10.1 C11.1 C12.1 C13.2 C14.2 C16.2 C18.2 C19.2 C21.2 C22.1 C23.1 C24.1 C25.1 C26.1 C27.1 C28.1 C29.1 C30.1 C31.1 C32.1 C33.1 C34.1 C35.1 C36.1 C37.1 C38.1 C39.1 C40.1 C41.1 C42.1 C43.1 C44.2 C45.1 C46.1 C47.1 C48.1 C49.1 C50.1 C51.1 C52.1 C53.2 C54.2 C55.2 C56.1 C57.1 C58.1 C59.1 C60.1 C61.1 C62.1 C63.1 C64.2 C65.2 C66.- C67.2 C68.1 C69.1 C70.1 C71.1 C72.1 C73.1 C74.1 C75.- C76.2 C77.1 C78.1 C79.1 C80.1 C81.1 C82.1 C83.1 C84.1 C85.1 C86.2 C87.1 C88.1 C89.1 C90.1 C91.- C92.1 C93.1 C94.1 C95.1 C96.1 C97.1 C98.1 C99.1 C100.1 C101.2 C102.1 C103.1 C104.1 C105.2 C106.1 C107.- C108.2 C109.2 C110.2 C111.2 C112.2 C113.1 C114.1 C115.1 C116.1 C117.1 C118.1 C119.1 C120.1 C121.1 C122.1 C123.- C124.2 C125.2 C126.1 C127.1 C128.1 C129.1 C130.1 C131.1 C132.1 C133.1 C134.1 C135.1 C136.1 C137.1 C138.1 C139.1 C140.1 C141.1 C142.1 C143.1 C144.1 C145.1 C146.1 C147.1 C148.1 C149.1 C150.1 C151.1 C152.1 C153.1 C154.1 C155.1 C158.1 C159.1 C160.1 C161.1 C162.1 C163.2 C166.1 C167.1 C168.1 C169.1 C194.2 C198.2 C199.2 C202.- C203.2 C204.2 C205.2 C207.2 C211.2 C212.2 C218.2 C219.2 C220.2 C221.2 CAN.3 CAN.6 D1.1(A) D5.A D7.1(A) D8.1(A) D9.1(A) D10.1(A) FET2.2(S) FET3.2(S) FET4.2(S) GND.1(PP) GND_PIN.P$1(PP) GPIO-1.2 GPIO-1.4 GPIO-1.12 GPIO-1.20 GPIO-1.26 GPIO-2.2 GPIO-2.4 JTAG.4 JTAG.6 JTAG.8 JTAG.10 JTAG.12 JTAG.14 JTAG.16 JTAG.18 JTAG.20 L5.1 L7.1 L12.1 LAN.GND1 LAN.GND2 LCD_CON.2 LCD_CON.4 LED1.C PWR.- PWR.-- PWR_LED.C Q2.GND R2.1 R7.1 R8.1 R9.1 R14.1 R15.2 R16.1 R20.1 R22.2 R23.2 R24.2 R26.2 R29.2 R43.2 R44.1 R45.1 R47.2 R53.2 R54.1 R61.1 R65.2 R71.1 R74.1 R78.2 R85.2 R86.2 R87.1(1.1) R91.2 R92.2 R124.2 R127.1 R129.1 RM14.4.1 RM26.1.1 RM26.3.1 RM26.4.1 RST.P$1 SD/MMC1.6(VSS) U1.A1(VSS) U1.A5(VSS_RTC) U1.A9(VREFN) U1.A18(VSS) U1.F8(VSS) U1.G8(VSS) U1.G9(VSS) U1.G11(VSS) U1.G12(VSS) U1.H6(VSS) U1.H7(VSS) U1.H8(VSS) U1.H9(VSS) U1.H10(VSS) U1.H12(VSS) U1.J6(VSS) U1.J7(VSS) U1.J8(VSS) U1.J9(VSS) U1.J10(VSS) U1.J11(VSS) U1.K7(VSS) U1.K9(VSS) U1.K10(VSS) U1.K11(VSS) U1.L10(VSS) U1.L11(VSS) U1.L12(VSS) U1.L13(VSS) U1.M6(VSS) U1.M7(VSS) U1.M8(VSS) U1.M9(VSS) U1.M10(VSS) U1.M12(VSS) U1.M14(VSSA_USB) U1.N7(VSS) U1.N10(VSS) U1.N11(VSS) U1.N14(VSSA_USB) U1.V1(VSS) U1.V11(VSS_OSC) U1.V18(VSS) U2.A1(VSS) U2.A8(VSS) U2.B1(VSS) U2.B2(VSSQ) U2.B8(VSSQ) U2.C9(VSSQ) U2.D1(VSSQ) U2.D8(VSS) U2.D9(VSSQ) U2.F2(VSS) U2.F8(VSS) U2.J1(VSS) U2.J9(VSS) U2.L1(VSS) U2.L9(VSS) U2.N1(VSS) U2.N9(VSS) U3.A1(VSS) U3.A8(VSS) U3.B1(VSS) U3.B2(VSSQ) U3.B8(VSSQ) U3.C9(VSSQ) U3.D1(VSSQ) U3.D8(VSS) U3.D9(VSSQ) U3.F2(VSS) U3.F8(VSS) U3.J1(VSS) U3.J9(VSS) U3.L1(VSS) U3.L9(VSS) U3.N1(VSS) U3.N9(VSS) U4.EXP_PAD(GND) U5.10(PWR:GND) U6.10(PWR:GND) U7.10(PWR:GND) U8.13(VSS) U8.36(VSS) U9.2(GND) U10.2(VSS) U11.2(GND) U12.2(GND) U13.2(GND) U14.4(GND) U15.2(GND) U16.3(GND) U17.2(GND) U22.14(TEST) U22.15(GND) U$1.GND(GND_ITX) U$1.P$2(GND_ITX) U$1.P$3(GND_ITX) U$1.P$4(GND_ITX) UEXT1.2 USB_HOST1.4 USB_HOST2.4 USB_HOST3.4 USB_HOST4.4 USB_OTG.GND VGA_DB15-F1.5 VGA_DB15-F1.6 VGA_DB15-F1.7 VGA_DB15-F1.8 VGA_DB15-F1.10 VR1.2(VSS)
GNDA: R87.2(1.2)
I2C2_SCL: R93.1 U1.D17(UART1_RTSN/TIMER5/DCAN0_RX/I2C2_SCL/SPI1_CS1/PR1_UART0_RTS_N/PR1_EDC_LATCH1_IN/GPIO0_13) UEXT1.5
I2C2_SDA: R94.1 U1.D18(UART1_CTSN/TIMER6/DCAN0_TX/I2C2_SDA/SPI1_CS0/PR1_UART0_CTS_N/PR1_EDC_LATCH0_IN/GPIO0_12) UEXT1.6
JTAG_TCK: JTAG.9 RM25.1.1 U1.A12(TCK)
JTAG_TDI: JTAG.5 RM25.3.1 U1.B11(TDI)
JTAG_TDO: JTAG.13 RM26.2.2 U1.A11(TDO)
JTAG_TMS: JTAG.7 RM25.2.1 U1.C11(TMS)
JTAG_TRST: JTAG.3 RM25.4.1 U1.B10(NTRST)
LCD_CLK: LCD_CON.31 U1.V5(LCD_PCLK/GPMC_A10/PR1_MII0_CRS/PR1_EDIO_DATA_IN4/PR1_EDIO_DATA_OUT4/PR1_PRU1_PRU_R30_10/PR1_PRU1_PRU_R31_10/GPIO2_24)
LCD_D0: LCD_CON.8 U1.R1(LCD_DATA0/GPMC_A0/PR1_MII_MT0_CLK/EHRPWM2A/PR1_PRU1_PRU_R30_0/PR1_PRU1_PRU_R31_0/GPIO2_6) U5.8(A:A4)
LCD_D1: LCD_CON.9 U1.R2(LCD_DATA1/GPMC_A1/PR1_MII0_TXEN/EHRPWM2B/PR1_PRU1_PRU_R30_1/PR1_PRU1_PRU_R31_1/GPIO2_7) U5.11(B:A1)
LCD_D2: LCD_CON.10 U1.R3(LCD_DATA2/GPMC_A2/PR1_MII0_TXD3/EHRPWM2_TRIPZONE_INPUT/PR1_PRU1_PRU_R30_2/PR1_PRU1_PRU_R31_2/GPIO2_8) U5.13(B:A2)
LCD_D3: LCD_CON.11 U1.R4(LCD_DATA3/GPMC_A3/PR1_MII0_TXD2/EHRPWM0_SYNCO/PR1_PRU1_PRU_R30_3/PR1_PRU1_PRU_R31_3/GPIO2_9) U5.15(B:A3)
LCD_D4: LCD_CON.12 U1.T1(LCD_DATA4/GPMC_A4/PR1_MII0_TXD1/EQEP2A_IN/PR1_PRU1_PRU_R30_4/PR1_PRU1_PRU_R31_4/GPIO2_10) U5.17(B:A4)
LCD_D5: LCD_CON.15 U1.T2(LCD_DATA5/GPMC_A5/PR1_MII0_TXD0/EQEP2B_IN/PR1_PRU1_PRU_R30_5/PR1_PRU1_PRU_R31_5/GPIO2_11) U6.6(A:A3)
LCD_D6: LCD_CON.16 U1.T3(LCD_DATA6/GPMC_A6/PR1_EDIO_DATA_IN6/EQEP2_INDEX/PR1_EDIO_DATA_OUT6/PR1_PRU1_PRU_R30_6/PR1_PRU1_PRU_R31_6/GPIO2_12) U6.8(A:A4)
LCD_D7: LCD_CON.17 U1.T4(LCD_DATA7/GPMC_A7/PR1_EDIO_DATA_IN7/EQEP2_STROBE/PR1_EDIO_DATA_OUT7/PR1_PRU1_PRU_R30_7/PR1_PRU1_PRU_R31_7/GPIO2_13) U6.11(B:A1)
LCD_D8: LCD_CON.18 U1.U1(LCD_DATA8/GPMC_A12/EHRPWM1_TRIPZONE_INPUT/MCASP0_ACLKX/UART5_TXD/PR1_MII0_RXD3/UART2_CTSN/GPIO2_14) U6.13(B:A2)
LCD_D9: LCD_CON.19 U1.U2(LCD_DATA9/GPMC_A13/EHRPWM0_SYNCO/MCASP0_FSX/UART5_RXD/PR1_MII0_RXD2/UART2_RTSN/GPIO2_15) U6.15(B:A3)
LCD_D10: LCD_CON.20 U1.U3(LCD_DATA10/GPMC_A14/EHRPWM1A/MCASP0_AXR0/PR1_MII0_RXD1/UART3_CTSN/GPIO2_16) U6.17(B:A4)
LCD_D11: LCD_CON.24 U1.U4(LCD_DATA11/GPMC_A15/EHRPWM1B/MCASP0_AHCLKR/MCASP0_AXR2/PR1_MII0_RXD0/UART3_RTSN/GPIO2_17) U7.8(A:A4)
LCD_D12: LCD_CON.25 U1.V2(LCD_DATA12/GPMC_A16/EQEP1A_IN/MCASP0_ACLKR/MCASP0_AXR2/PR1_MII0_RXLINK/UART4_CTSN/GPIO0_8) U7.11(B:A1)
LCD_D13: LCD_CON.26 U1.V3(LCD_DATA13/GPMC_A17/EQEP1B_IN/MCASP0_FSR/MCASP0_AXR3/PR1_MII0_RXER/UART4_RTSN/GPIO0_9) U7.13(B:A2)
LCD_D14: LCD_CON.27 U1.V4(LCD_DATA14/GPMC_A18/EQEP1_INDEX/MCASP0_AXR1/UART5_RXD/PR1_MII_MR0_CLK/UART5_CTSN/GPIO0_10) U7.15(B:A3)
LCD_D15: LCD_CON.28 U1.T5(LCD_DATA15/GPMC_A19/EQEP1_STROBE/MCASP0_AHCLKX/MCASP0_AXR3/PR1_MII0_RXDV/UART5_RTSN/GPIO0_11) U7.17(B:A4)
LCD_D16: LCD_CON.7 U1.U13(GPMC_AD15/LCD_DATA16/MMC1_DAT7/MMC2_DAT3/EQEP2_STROBE/PR1_ECAP0_ECAP_CAPIN_APWM_O/PR1_PRU0_PRU_R31_15/GPIO1_15) U5.6(A:A3)
LCD_D17: LCD_CON.23 U1.V13(GPMC_AD14/LCD_DATA17/MMC1_DAT6/MMC2_DAT2/EQEP2_INDEX/PR1_MII0_TXD0/PR1_PRU0_PRU_R31_14/GPIO1_14) U7.6(A:A3)
LCD_D18: LCD_CON.6 U1.R12(GPMC_AD13/LCD_DATA18/MMC1_DAT5/MMC2_DAT1/EQEP2B_IN/PR1_MII0_TXD1/PR1_PRU0_PRU_R30_15/GPIO1_13) U5.4(A:A2)
LCD_D19: LCD_CON.14 U1.T12(GPMC_AD12/LCD_DATA19/MMC1_DAT4/MMC2_DAT0/EQEP2A_IN/PR1_MII0_TXD2/PR1_PRU0_PRU_R30_14/GPIO1_12) U6.4(A:A2)
LCD_D20: LCD_CON.22 U1.U12(GPMC_AD11/LCD_DATA20/MMC1_DAT3/MMC2_DAT7/EHRPWM0_SYNCO/PR1_MII0_TXD3/GPIO0_27) U7.4(A:A2)
LCD_D21: LCD_CON.5 U1.T11(GPMC_AD10/LCD_DATA21/MMC1_DAT2/MMC2_DAT6/EHRPWM2_TRIPZONE_INPUT/PR1_MII0_TXEN/GPIO0_26) U5.2(A:A1)
LCD_D22: LCD_CON.13 U1.T10(GPMC_AD9/LCD_DATA22/MMC1_DAT1/MMC2_DAT5/EHRPWM2B/PR1_MII0_COL/GPIO0_23) U6.2(A:A1)
LCD_D23: LCD_CON.21 U1.U10(GPMC_AD8/LCD_DATA23/MMC1_DAT0/MMC2_DAT4/EHRPWM2A/PR1_MII_MT0_CLK/GPIO0_22) U7.2(A:A1)
LCD_DE: LCD_CON.32 R120.1 U1.R6(LCD_AC_BIAS_EN/GPMC_A11/PR1_MII1_CRS/PR1_EDIO_DATA_IN5/PR1_EDIO_DATA_OUT5/PR1_PRU1_PRU_R30_11/PR1_PRU1_PRU_R31_11/GPIO2_25)
LCD_HSYNC: LCD_CON.29 R117.1 U1.R5(LCD_HSYNC/GPMC_A9/PR1_EDIO_DATA_IN3/PR1_EDIO_DATA_OUT3/PR1_PRU1_PRU_R30_9/PR1_PRU1_PRU_R31_9/GPIO2_23)
LCD_PWR_EN: LCD_CON.35 U1.U18(GPMC_BE1N/GMII2_COL/GPMC_CSN6/MMC2_DAT3/GPMC_DIR/PR1_MII1_RXLINK/MCASP0_ACLKR/GPIO1_28)
LCD_VSYNC: LCD_CON.30 R116.1 U1.U5(LCD_VSYNC/GPMC_A8/PR1_EDIO_DATA_IN2/PR1_EDIO_DATA_OUT2/PR1_PRU1_PRU_R30_8/PR1_PRU1_PRU_R31_8/GPIO2_22)
MMC0-SDCD#: RM14.4.2 SD/MMC1.10(CP_E) U1.C15(SPI0_CS1/UART3_RXD/ECAP1_IN_PWM1_OUT/MMC0_POW/XDMA_EVENT_INTR2/MMC0_SDCD/EMU4/GPIO0_6)
MMC0_CLKO: SD/MMC1.5(CLK/SCLK) U1.G17(MMC0_CLK/GPMC_A24/UART3_CTSN/UART2_RXD/DCAN1_TX/PR1_PRU0_PRU_R30_12/PR1_PRU0_PRU_R31_12/GPIO2_30)
MMC0_CMD: R30.1 SD/MMC1.3(CMD/DI) U1.G18(MMC0_CMD/GPMC_A25/UART3_RTSN/UART2_TXD/DCAN1_RX/PR1_PRU0_PRU_R30_13/PR1_PRU0_PRU_R31_13/GPIO2_31)
MMC0_DAT0: RM14.2.1 SD/MMC1.7(DAT0/DO) U1.G16(MMC0_DAT0/GPMC_A23/UART5_RTSN/UART3_TXD/UART1_RIN/PR1_PRU0_PRU_R30_11/PR1_PRU0_PRU_R31_11/GPIO2_29)
MMC0_DAT1: RM14.3.1 SD/MMC1.8(DAT1/RES) U1.G15(MMC0_DAT1/GPMC_A22/UART5_CTSN/UART3_RXD/UART1_DTRN/PR1_PRU0_PRU_R30_10/PR1_PRU0_PRU_R31_10/GPIO2_28)
MMC0_DAT2: RM14.1.1 SD/MMC1.1(DAT2/RES) U1.F18(MMC0_DAT2/GPMC_A21/UART4_RTSN/TIMER6/UART1_DSRN/PR1_PRU0_PRU_R30_9/PR1_PRU0_PRU_R31_9/GPIO2_27)
MMC0_DAT3: R29.1 SD/MMC1.2(CD/DAT3/CS) U1.F17(MMC0_DAT3/GPMC_A20/UART4_CTSN/TIMER5/UART1_DCDN/PR1_PRU0_PRU_R30_8/PR1_PRU0_PRU_R31_8/GPIO2_26)
N$1: C148.2 U1.C10(CAP_VBB_MPU)
N$2: R16.2 U1.J3(DDR_VTP)
N$3: R7.2 U2.H8(ZQ)
N$4: L9.1 U11.3(LX)
N$5: R9.2 U3.H8(ZQ)
N$6: R20.2 U4.32(RBIAS)
N$7: C11.2 U1.D6(CAP_VDD_RTC)
N$8: L18.1 U13.3(LX)
N$9: 1.1V_CPU_E.1 C14.1 C15.1 C16.1 L9.2 R3.1
N$10: LAN.AG R15.1 U4.2(LED2/NINTSEL)
N$11: C15.2 R3.2 R43.1 U11.5(FB)
N$12: R23.1 U1.B4(ENZ_KALDO_1P8V(RTC_KALDO_ENN))
N$13: L10.1 U12.3(LX)
N$14: C46.2 C47.2 U4.6(VDDCR)
N$15: TP1-USBCE.1(PP) U1.M15(USB0_CE)
N$16: 1.25V_MPU_E.1 C19.1 C20.1 C21.1 L10.2 R51.1
N$17: C48.2 C49.2 C50.2 L22.1 R4.2 R10.2 R11.2 R12.2 R17.2(1.2) U4.1(VDD2A) U4.27(VDD1A)
N$18: 1.5V_E.1 C195.1 C198.1 C199.1 L18.2 R77.1
N$19: C195.2 R77.2 R78.1 U13.5(FB)
N$20: R112.1 U7.5(B:Y3)
N$21: R110.1 U7.9(B:Y1)
N$22: C20.2 R51.2 R53.1 U12.5(FB)
N$23: C149.2 U1.D11(CAP_VDD_SRAM_MPU)
N$24: R108.1 U7.14(A:Y3)
N$25: C150.2 U1.D9(CAP_VDD_SRAM_CORE)
N$26: C156.1 C157.1 L12.2 U1.E8(VSSA_ADC)
N$27: FET2.1(G) R116.2
N$28: C156.2 C157.2 C158.2 C159.2 L11.2 U1.B9(VREFP) U1.D8(VDDA_ADC)
N$29: FET3.1(G) R117.2
N$30: FET4.1(G) R120.2
N$31: C202.+ D5.C PWR.+ R79.1 U14.2(IN)
N$32: R13.2(1.2) R25.2 U4.19(NRST)
N$33: R35.1 U5.16(A:Y2)
N$34: C151.2 C152.2 C153.2 C154.2 C155.2 L13.2 U1.D10(VDDS_SRAM_MPU_BB) U1.E7(VDDS_PLL_DDR) U1.E9(VDDS_SRAM_CORE_BG) U1.H15(VDDS_PLL_MPU) U1.R10(VDDS_PLL_CORE_LCD)
N$35: TP2.1(PP) U1.P17(USB1_ID)
N$36: C203.1 U14.8(SS)
N$37: R79.2 U14.7(EN)
N$38: TP3.1(PP) U1.P18(USB1_CE)
N$39: LAN.1(TD+) R4.1 U4.29(TXP)
N$40: LAN.2(TD-) R10.1 U4.28(TXN)
N$41: LAN.7(RD+) R11.1 U4.31(RXP)
N$42: R71.2 U17.3(ISET)
N$43: NMI.P$2 R96.1
N$44: C218.1 NMI.P$1 R55.2 R91.1
N$45: LAN.8(RD-) R12.1 U4.30(RXN)
N$46: C200.1 U14.1(BS)
N$47: R38.1 U5.18(A:Y1)
N$48: R56.2 U4.18(NINT/TXER/TXD4)
N$49: R41.1 U6.16(A:Y2)
N$50: C200.2 L19.1 U14.3(SW)
N$51: R114.1 U6.18(A:Y1)
N$52: R115.1 U7.16(A:Y2)
N$53: LAN.KG R22.1
N$54: LAN.AY U4.3(LED1/REGOFF)
N$55: R122.1 U7.18(A:Y1)
N$56: C45.2 LAN.3(COM) LAN.6(NC) R17.1(1.1)
N$57: LAN.KY R26.1
N$58: R33.1 SD/MMC1.12(PACK)
N$59: R61.2 U1.C5(EXT_WAKEUP)
N$60: C201.1 U14.6(COMP)
N$61: C201.2 R85.1
N$62: R80.1 R86.1 U14.5(FB)
N$63: R57.2 R58.1 RST.P$2
N$64: L21.1 U15.3(LX)
N$65: 3.3V_E.1 C208.1 C211.1 C212.1 L21.2 R89.1
N$66: C208.2 R89.2 R92.1 U15.5(FB)
N$67: R74.2 U22.4(RREF)
N$68: R123.2 U22.18(PGANG)
N$69: TP4.1(PP) U1.A3(TESTOUT)
N$70: D4.2(A) T1.1(B)
N$71: C165.2 D4.1(C) R65.1
N$78: L5.2 USB_HOST1.P$3 USB_HOST1.P$4 USB_HOST2.P$3 USB_HOST2.P$4 USB_HOST3.P$3 USB_HOST3.P$4 USB_HOST4.P$3 USB_HOST4.P$4
N$79: C65.1 L2.2 USB_HOST1.1
N$80: R47.1 R154.1 U10.8(RS)
N$81 [PWR]: HOST_EN.2 R72.2 R129.2 U17.4(EN)
N$82: C76.1 L8.2 USB_HOST4.1
N$83: C66.+ C75.+ C91.+ C107.+ L2.1 L3.1 L8.1 L23.1 R46.2 R126.2 U17.1(OUT)
N$84: CAN.5 R54.2
N$86: C97.2 Q2.1 U1.A4(OSC1_OUT)
N$99: R45.2 U9.3(ISET)
N$100: C123.+ L6.2 R42.2 U9.1(OUT)
N$103: R113.1 U7.3(B:Y4)
N$106: R128.2 U22.17(PSELF)
N$107: R111.1 U7.7(B:Y2)
N$109: R109.1 U7.12(A:Y4)
N$112: C67.1 L3.2 USB_HOST2.1
N$113: C105.1 L23.2 USB_HOST3.1
N$116: C98.2 Q2.2 U1.A6(OSC1_IN)
N$117: R66.1 U6.9(B:Y1)
N$118: R68.1 U6.7(B:Y2)
N$119: C74.2 R124.1 R125.1 U22.13(#RESET)
N$129: PWR_LED.A R81.2
N$138: R106.1 U6.5(B:Y3)
N$172: R107.1 U6.3(B:Y4)
N$173: R60.1 U6.14(A:Y3)
N$174: R64.1 U6.12(A:Y4)
N$177: R31.1 U5.9(B:Y1)
N$178: R34.1 U5.7(B:Y2)
N$179: R39.1 U5.5(B:Y3)
N$180: R40.1 U5.3(B:Y4)
N$181: R27.1 U5.14(A:Y3)
N$182: R28.1 U5.12(A:Y4)
N$188: JTAG.11 RM26.1.2
N$189: JTAG.17 RM26.3.2
N$229: LCD_CON.33 R49.1
N$230: LCD_CON.34 R50.1
N$231: LED1.A R32.2
N$232: NAND_E.1 R19.2 U8.9(#CE)
N$266: L7.2 USB_OTG.GND1 USB_OTG.GND2 USB_OTG.GND3 USB_OTG.GND4
N$566: CAN_T.1 R48.1
NNMI: GPIO-1.6 R55.1 R56.1 U1.B18(NNMI)
NWP: C88.2 R21.2 U1.U17(GPMC_WPN/GMII2_RXERR/GPMC_CSN5/RMII2_RXERR/MMC2_SDCD/PR1_MII1_TXEN/UART4_TXD/GPIO0_31) U8.19(#WP)
PIN0: GPIO-1.7 U1.D12(MCASP0_AXR0/EHRPWM0_TRIPZONE_INPUT/SPI1_D1/MMC2_SDCD/PR1_PRU0_PRU_R30_2/PR1_PRU0_PRU_R31_2/GPIO3_16)
PIN1: GPIO-1.9 U1.D13(MCASP0_AXR1/EQEP0_INDEX/MCASP1_AXR0/EMU3/PR1_PRU0_PRU_R30_6/PR1_PRU0_PRU_R31_6/GPIO3_20)
PIN2: GPIO-1.10 U1.C12(MCASP0_AHCLKR/EHRPWM0_SYNCI/MCASP0_AXR2/SPI1_CS0/ECAP2_IN_PWM2_OUT/PR1_PRU0_PRU_R30_3/PR1_PRU0_PRU_R31_3/GPIO3_17)
PIN3: GPIO-1.8 U1.C13(MCASP0_FSR/EQEP0B_IN/MCASP0_AXR3/MCASP1_FSX/EMU2/PR1_PRU0_PRU_R30_5/PR1_PRU0_PRU_R31_5/GPIO3_19)
PIN4/I2C0-SCL: GPIO-2.5 R82.1 U1.C16(I2C0_SCL/TIMER7/UART2_RTSN/ECAP1_IN_PWM1_OUT/GPIO3_6)
PIN5/I2C0-SDA: GPIO-2.7 R83.1 U1.C17(I2C0_SDA/TIMER4/UART2_CTSN/ECAP2_IN_PWM2_OUT/GPIO3_5)
PIN6/EHRPWM1A: GPIO-2.9 LCD_CON.36 U1.U14(GPMC_A2/GMII2_TXD3/RGMII2_TD3/MMC2_DAT1/GPMC_A18/PR1_MII1_TXD2/EHRPWM1A/GPIO1_18)
PIN7: GPIO-2.11 R49.2 U1.T14(GPMC_A3/GMII2_TXD2/RGMII2_TD2/MMC2_DAT2/GPMC_A19/PR1_MII1_TXD1/EHRPWM1B/GPIO1_19)
PIN8: GPIO-2.13 R50.2 U1.R14(GPMC_A4/GMII2_TXD1/RGMII2_TD1/RMII2_TXD1/GPMC_A20/PR1_MII1_TXD0/EQEP1A_IN/GPIO1_20)
PIN9: GPIO-2.15 U1.V15(GPMC_A5/GMII2_TXD0/RGMII2_TD0/RMII2_TXD0/GPMC_A21/PR1_MII1_RXD3/EQEP1B_IN/GPIO1_21)
PIN10/I2C1-SCL: GPIO-2.17 U1.E17(UART0_RTSN/UART4_TXD/DCAN1_RX/I2C1_SCL/SPI1_D1/SPI1_CS0/PR1_EDC_SYNC1_OUT/GPIO1_9)
PIN11/I2C1-SDA: GPIO-2.19 U1.E18(UART0_CTSN/UART4_RXD/DCAN1_TX/I2C1_SDA/SPI1_D0/TIMER7/PR1_EDC_SYNC0_OUT/GPIO1_8)
PIN12/NWE: GPIO-2.21 U1.U6(GPMC_WEN/TIMER6/GPIO2_4) U8.18(#WE)
PIN13/NALE: GPIO-2.23 U1.R7(GPMC_ADVN_ALE/TIMER4/GPIO2_2) U8.17(ALE)
PIN14/NCLE: GPIO-2.25 U1.T6(GPMC_BE0N_CLE/TIMER5/GPIO2_5) U8.16(CLE)
PIN15/NCE1: GPIO-2.27 U1.U9(GPMC_CSN1/GPMC_CLK/MMC1_CLK/PR1_EDIO_DATA_IN6/PR1_EDIO_DATA_OUT6/PR1_PRU1_PRU_R30_12/PR1_PRU1_PRU_R31_12/GPIO1_30)
PIN16/NCE0: GPIO-2.29 NAND_E.2 U1.V6(GPMC_CSN0/GPIO1_29)
PIN17/NRE: GPIO-2.31 U1.T7(GPMC_OEN_REN/TIMER7/GPIO2_3) U8.8(#RE)
PIN18/NRB0: GPIO-2.33 R18.2 U1.T17(GPMC_WAIT0/GMII2_CRS/GPMC_CSN4/RMII2_CRS_DV/MMC1_SDCD/PR1_MII1_COL/UART4_RXD/GPIO0_30) U8.7(R/#B)
PIN19/NRB1: GPIO-2.35 U1.V12(GPMC_CLK/LCD_MEMORY_CLK/GPMC_WAIT1/MMC2_CLK/PR1_MII1_CRS/PR1_MDIO_MDCLK/MCASP0_FSR/GPIO2_1)
PIN20/NDQ0: GPIO-2.37 U1.U7(GPMC_AD0/MMC1_DAT0/GPIO1_0) U8.29(I/O0)
PIN21/NDQ1: GPIO-2.39 U1.V7(GPMC_AD1/MMC1_DAT1/GPIO1_1) U8.30(I/O1)
PIN22/NDQ2: GPIO-2.40 U1.R8(GPMC_AD2/MMC1_DAT2/GPIO1_2) U8.31(I/O2)
PIN23/NDQ3: GPIO-2.38 U1.T8(GPMC_AD3/MMC1_DAT3/GPIO1_3) U8.32(I/O3)
PIN24/NDQ4: GPIO-2.36 U1.U8(GPMC_AD4/MMC1_DAT4/GPIO1_4) U8.41(I/O4)
PIN25/NDQ5: GPIO-2.34 U1.V8(GPMC_AD5/MMC1_DAT5/GPIO1_5) U8.42(I/O5)
PIN26/NDQ6: GPIO-2.32 U1.R9(GPMC_AD6/MMC1_DAT6/GPIO1_6) U8.43(I/O6)
PIN27/NDQ7: GPIO-2.30 U1.T9(GPMC_AD7/MMC1_DAT7/GPIO1_7) U8.44(I/O7)
PIN28/NDQS: GPIO-2.28 U1.V9(GPMC_CSN2/GPMC_BE1N/MMC1_CMD/PR1_EDIO_DATA_IN7/PR1_EDIO_DATA_OUT7/PR1_PRU1_PRU_R30_13/PR1_PRU1_PRU_R31_13/GPIO1_31)
PIN29: GPIO-2.26 U1.U15(GPMC_A6/GMII2_TXCLK/RGMII2_TCLK/MMC2_DAT4/GPMC_A22/PR1_MII1_RXD2/EQEP1_INDEX/GPIO1_22)
PIN30: GPIO-2.24 U1.T15(GPMC_A7/GMII2_RXCLK/RGMII2_RCLK/MMC2_DAT5/GPMC_A23/PR1_MII1_RXD1/EQEP1_STROBE/GPIO1_23)
PIN31: GPIO-2.22 U1.V16(GPMC_A8/GMII2_RXD3/RGMII2_RD3/MMC2_DAT6/GPMC_A24/PR1_MII1_RXD0/MCASP0_ACLKX/GPIO1_24)
PIN32: GPIO-2.20 U1.U16(GPMC_A9/GMII2_RXD2/RGMII2_RD2/MMC2_DAT7/GPMC_A25/PR1_MII_MR1_CLK/MCASP0_FSX/GPIO1_25)
PIN33: GPIO-2.18 U1.T16(GPMC_A10/GMII2_RXD1/RGMII2_RD1/RMII2_RXD1/GPMC_A26/PR1_MII1_RXDV/MCASP0_AXR0/GPIO1_26)
PIN34: GPIO-2.16 U1.V17(GPMC_A11/GMII2_RXD0/RGMII2_RD0/RMII2_RXD0/GPMC_A27/PR1_MII1_RXER/MCASP0_AXR1/GPIO1_27)
PIN35: GPIO-2.14 U1.V14(GPMC_A1/GMII2_RXDV/RGMII2_RCTL/MMC2_DAT0/GPMC_A17/PR1_MII1_TXD3/EHRPWM0_SYNCO/GPIO1_17)
PIN36/CAN_CTRL: GPIO-2.12 R154.2 U1.R13(GPMC_A0/GMII2_TXEN/RGMII2_TCTL/RMII2_TXEN/GPMC_A16/PR1_MII_MT1_CLK/EHRPWM1_TRIPZONE_INPUT/GPIO1_16)
PIN37/LED1 [PWR]: GPIO-2.10 R32.1 U1.T13(GPMC_CSN3/MMC2_CMD/PR1_MII0_CRS/PR1_MDIO_DATA/EMU4/GPIO2_0)
PIN38: GPIO-2.8 U1.C14(EMU0/GPIO3_7)
PIN39 [PWR]: GPIO-2.6 U1.B14(EMU1/GPIO3_8)
PIN40: GPIO-1.11 U1.B12(MCASP0_ACLKR/EQEP0A_IN/MCASP0_AXR2/MCASP1_ACLKX/MMC0_SDWP/PR1_PRU0_PRU_R30_4/PR1_PRU0_PRU_R31_4/GPIO3_18)
PIN41: GPIO-1.13 U1.B13(MCASP0_FSX/EHRPWM0B/SPI1_D0/MMC1_SDCD/PR1_PRU0_PRU_R30_1/PR1_PRU0_PRU_R31_1/GPIO3_15)
PIN42: GPIO-1.15 U1.A13(MCASP0_ACLKX/EHRPWM0A/SPI1_SCLK/MMC0_SDCD/PR1_PRU0_PRU_R30_0/PR1_PRU0_PRU_R31_0/GPIO3_14)
PIN43: GPIO-1.17 U1.A14(MCASP0_AHCLKX/EQEP0_STROBE/MCASP0_AXR3/MCASP1_AXR1/EMU4/PR1_PRU0_PRU_R30_7/PR1_PRU0_PRU_R31_7/GPIO3_21)
PIN44: GPIO-1.18 U1.A15(XDMA_EVENT_INTR0/TIMER4/CLKOUT1/SPI1_CS1/PR1_PRU1_PRU_R31_16/EMU2/GPIO0_19)
PIN45: GPIO-1.16 U1.D14(XDMA_EVENT_INTR1/TCLKIN/CLKOUT2/TIMER7/PR1_PRU0_PRU_R31_16/EMU3/GPIO0_20)
PIN46: GPIO-1.14 U1.C18(ECAP0_IN_PWM0_OUT/UART3_TXD/SPI1_CS1/PR1_ECAP0_ECAP_CAPIN_APWM_O/SPI1_SCLK/MMC0_SDWP/XDMA_EVENT_INTR2/GPIO0_7)
PWRONRSTN: C92.2 R59.2 U1.B15(PORZ(PWRONRSTN))
RASN: U1.G4(DDR_RASN) U2.F3(#RAS) U3.F3(#RAS)
RTC_PORZ: R24.1 T1.3(C) U1.B5(RTC_PORZ(RTC_PWRONRSTN))
SA0: U1.F3(DDR_A0) U2.K3(A0) U3.K3(A0)
SA1: U1.H1(DDR_A1) U2.L7(A1) U3.L7(A1)
SA2: U1.E4(DDR_A2) U2.L3(A2) U3.L3(A2)
SA3: U1.C3(DDR_A3) U2.K2(A3) U3.K2(A3)
SA4: U1.C2(DDR_A4) U2.L8(A4) U3.L8(A4)
SA5: U1.B1(DDR_A5) U2.L2(A5) U3.L2(A5)
SA6: U1.D5(DDR_A6) U2.M8(A6) U3.M8(A6)
SA7: U1.E2(DDR_A7) U2.M2(A7) U3.M2(A7)
SA8: U1.D4(DDR_A8) U2.N8(A8) U3.N8(A8)
SA9: U1.C1(DDR_A9) U2.M3(A9) U3.M3(A9)
SA10: U1.F4(DDR_A10) U2.H7(A10/AP) U3.H7(A10/AP)
SA11: U1.F2(DDR_A11) U2.M7(A11) U3.M7(A11)
SA12: U1.E3(DDR_A12) U2.K7(A12/#BC) U3.K7(A12/#BC)
SA13: U1.H3(DDR_A13) U2.N3(A13) U3.N3(A13)
SA14: U1.H4(DDR_A14) U2.N7(A14) U3.N7(A14)
SCK: R118.2 U1.D2(DDR_CK)
SCK#: R119.2 U1.D1(DDR_NCK)
SCS0: U1.H2(DDR_CSN0) U2.H2(#CS) U3.H2(#CS)
SD_VCC: C103.2 C104.2 L4.2 SD/MMC1.4(VDD)
SDQM0: U1.M2(DDR_DQM0) U2.B7(DM/TDQS)
SDQM1: U1.J2(DDR_DQM1) U3.B7(DM/TDQS)
SDQS0: U1.P1(DDR_DQS0) U2.C3(DQS)
SDQS0_N: U1.P2(DDR_DQSN0) U2.D3(#DQS)
SDQS1: U1.L1(DDR_DQS1) U3.C3(DQS)
SDQS1_N: U1.L2(DDR_DQSN1) U3.D3(#DQS)
SPI0_CS0: R95.1 U1.A16(SPI0_CS0/MMC2_SDWP/I2C1_SCL/EHRPWM0_SYNCI/PR1_UART0_TXD/PR1_EDIO_DATA_IN1/PR1_EDIO_DATA_OUT1/GPIO0_5) UEXT1.10
SPI0_D0(MISO): U1.B17(SPI0_D0/UART2_TXD/I2C2_SCL/EHRPWM0B/PR1_UART0_RTS_N/PR1_EDIO_LATCH_IN/EMU3/GPIO0_3) UEXT1.7
SPI0_D1(MOSI): U1.B16(SPI0_D1/MMC1_SDWP/I2C1_SDA/EHRPWM0_TRIPZONE_INPUT/PR1_UART0_RXD/PR1_EDIO_DATA_IN0/PR1_EDIO_DATA_OUT0/GPIO0_4) UEXT1.8
SPI0_SCLK: U1.A17(SPI0_SCLK/UART2_RXD/I2C2_SDA/EHRPWM0A/PR1_UART0_CTS_N/PR1_EDIO_SOF/EMU2/GPIO0_2) UEXT1.9
SYS_RESETN: GPIO-1.5 JTAG.15 R13.1(1.1) R57.1 R63.1 U1.A10(NRESETIN_OUT(WARMRSTN)) U16.1(RESET)
TPX1: C127.2 LCD_CON.37 U1.B6(AIN0)
TPX2: C129.2 LCD_CON.38 U1.C7(AIN1)
TPY1: C131.2 LCD_CON.39 U1.B7(AIN2)
TPY2: C132.2 LCD_CON.40 U1.A7(AIN3)
UART1_RXD: U1.D16(UART1_RXD/MMC1_SDWP/DCAN1_TX/I2C1_SDA/PR1_UART0_RXD/PR1_PRU1_PRU_R31_16/GPIO0_14) UEXT1.4
UART1_TXD: U1.D15(UART1_TXD/MMC2_SDWP/DCAN1_RX/I2C1_SCL/PR1_UART0_TXD/PR1_PRU0_PRU_R31_16/GPIO0_15) UEXT1.3
USB0-DRV: R44.2 U1.F16(USB0_DRVVBUS/GPIO0_18) U9.4(EN)
USB0-ID: R52.2 U1.P16(USB0_ID) USB_OTG.ID
USB0-VBUS: R42.1 U1.P15(USB0_VBUS)
USB0_DM: U1.N18(USB0_DM) USB_OTG.D-
USB0_DP: U1.N17(USB0_DP) USB_OTG.D+
USB1-VBUS: R46.1 U1.T18(USB1_VBUS)
USB1_DM: U1.R18(USB1_DM) U22.25(DM0)
USB1_DP: U1.R17(USB1_DP) U22.26(DP0)
USB1_DRV [PWR]: HOST_EN.1 U1.F15(USB1_DRVVBUS/GPIO3_13)
V+: 1.5V.1(PP) 1.5V_E.2 C1.1 C2.2 C3.2 C4.2 C5.2 C6.2 C7.2 C8.2 C9.2 C17.1 C29.2 C30.2 C31.2 C32.2 C33.2 C34.2 C37.2 C38.2 C39.2 C40.2 C41.2 C42.2 R1.2 R6.2 U1.E5(VDDS_DDR) U1.F5(VDDS_DDR) U1.G5(VDDS_DDR) U1.H5(VDDS_DDR) U1.J5(VDDS_DDR) U1.K5(VDDS_DDR) U1.L5(VDDS_DDR) U2.A2(VDD) U2.A9(VDD) U2.B9(VDDQ) U2.C1(VDDQ) U2.D7(VDD) U2.E2(VDDQ) U2.E9(VDDQ) U2.G2(VDD) U2.G8(VDD) U2.K1(VDD) U2.K9(VDD) U2.M1(VDD) U2.M9(VDD) U3.A2(VDD) U3.A9(VDD) U3.B9(VDDQ) U3.C1(VDDQ) U3.D7(VDD) U3.E2(VDDQ) U3.E9(VDDQ) U3.G2(VDD) U3.G8(VDD) U3.K1(VDD) U3.K9(VDD) U3.M1(VDD) U3.M9(VDD) ; supply symbol labelled 1.5V
VCC [PWR]: 3.3V.1(PP) 3.3V_E.2 C10.2 C44.1 C51.2 C52.2 C53.1 C54.1 C59.2 C60.2 C61.2 C62.2 C68.2 C69.2 C70.2 C77.2 C78.2 C79.2 C80.2 C81.2 C82.2 C83.2 C84.2 C85.2 C86.1 C89.2 C90.2 C122.2 C144.2 C145.2 C146.2 C147.2 C161.2 C163.1 C219.1 D1.2(K) D7.2(K) D8.2(K) GPIO-1.3 GPIO-1.19 GPIO-2.3 JTAG.1 JTAG.2 L4.1 L22.2 LCD_CON.3 R18.1 R19.1 R21.1 R30.2 R33.2 R52.1 R58.2 R59.1 R63.2 R72.1 R82.2 R83.2 R93.2 R94.2 R95.2 R96.2 R121.2 RM12.1.1 RM12.2.1 RM12.3.1 RM12.4.1 RM14.1.2 RM14.2.2 RM14.3.2 RM25.1.2 RM25.2.2 RM25.3.2 RM25.4.2 RM26.2.1 U1.E10(VDDSHV6) U1.E11(VDDSHV6) U1.E12(VDDSHV6) U1.E13(VDDSHV6) U1.F14(VDDSHV6) U1.G14(VDDSHV6) U1.H14(VDDSHV4) U1.J14(VDDSHV4) U1.K14(VDDSHV5) U1.L14(VDDSHV5) U1.N5(VDDSHV6) U1.N15(VDDA3P3V_USB0) U1.P5(VDDSHV6) U1.P6(VDDSHV6) U1.P7(VDDSHV1) U1.P8(VDDSHV1) U1.P10(VDDSHV2) U1.P11(VDDSHV2) U1.P12(VDDSHV3) U1.P13(VDDSHV3) U1.R15(VDDA3P3V_USB1) U4.12(VDDIO) U5.20(PWR:VCC) U6.20(PWR:VCC) U7.20(PWR:VCC) U8.12(VCC) U8.37(VCC) U10.3(VDD) U16.2(VCC) UEXT1.1 VR1.1(VIN) VR1.3(CE) ; supply symbol labelled 3.3V
VCC/2: 1.1V.1(PP) 1.1V_CPU_E.2 C87.2 C93.2 C94.2 C95.2 C96.2 C106.2 C113.2 C114.2 C115.2 C116.2 C117.2 C118.2 C119.2 C120.2 C121.2 C126.2 C128.2 C130.2 C133.2 C134.2 C135.2 U1.F6(VDD_CORE) U1.F7(VDD_CORE) U1.G6(VDD_CORE) U1.G7(VDD_CORE) U1.G10(VDD_CORE) U1.H11(VDD_CORE) U1.J12(VDD_CORE) U1.K6(VDD_CORE) U1.K8(VDD_CORE) U1.K12(VDD_CORE) U1.L6(VDD_CORE) U1.L7(VDD_CORE) U1.L8(VDD_CORE) U1.L9(VDD_CORE) U1.M11(VDD_CORE) U1.M13(VDD_CORE) U1.N8(VDD_CORE) U1.N9(VDD_CORE) U1.N12(VDD_CORE) U1.N13(VDD_CORE) ; supply symbol labelled 1.1V_CPU
VCCINT: 1.25V.1(PP) 1.25V_MPU_E.2 C136.2 C137.2 C138.2 C139.2 C140.2 C141.2 C142.2 C143.2 U1.A2(VDD_MPU_MON) U1.F10(VDD_MPU) U1.F11(VDD_MPU) U1.F12(VDD_MPU) U1.F13(VDD_MPU) U1.G13(VDD_MPU) U1.H13(VDD_MPU) U1.J13(VDD_MPU) ; supply symbol labelled 1.25V_MPU
VDD: 1.8V.1(PP) C22.2 C23.2 C24.2 C25.2 C26.2 C27.2 C43.2 C57.2 C58.2 C102.2 C160.2 C162.2 C165.1 C220.1 C221.1 GPIO-1.25 L11.1 L13.1 T1.2(E) U1.D7(VDDS_RTC) U1.E6(VDDS) U1.E14(VDDS) U1.F9(VDDS) U1.K13(VDDS) U1.N6(VDDS) U1.N16(VDDA1P8V_USB0) U1.P9(VDDS) U1.P14(VDDS) U1.R11(VDDS_OSC) U1.R16(VDDA1P8V_USB1) VR1.5(VOUT) ; supply symbol labelled 1.8V
VGA_B: D8.3(AK) R108.2 R109.2 R110.2 R111.2 R112.2 R113.2 R115.2 R122.2 VGA_DB15-F1.3
VGA_CTRL [PWR]: FET4.3(D) R121.1 U5.1(A:G) U5.19(B:G) U6.1(A:G) U6.19(B:G) U7.1(A:G) U7.19(B:G)
VGA_G: D7.3(AK) R41.2 R60.2 R64.2 R66.2 R68.2 R106.2 R107.2 R114.2 VGA_DB15-F1.2
VGA_HSYNC: D9.3(AK) FET3.3(D) R36.1 VGA_DB15-F1.13
VGA_R: D1.3(AK) R27.2 R28.2 R31.2 R34.2 R35.2 R38.2 R39.2 R40.2 VGA_DB15-F1.1
VGA_VSYNC: D10.3(AK) FET2.3(D) R37.1 VGA_DB15-F1.14
WEN: U1.B2(DDR_WEN) U2.H3(#WE) U3.H3(#WE)
X1: C56.2 Q4.2 U22.6(X1)
X2: C63.2 Q4.1 U22.7(X2)
XTALI: C99.2 Q3.2 U1.U11(OSC0_OUT)
XTALI1: C72.2 Q1.2 U4.4(XTAL2)
XTALO: C100.2 Q3.1 U1.V10(OSC0_IN)
XTALO1: C73.2 Q1.1 U4.5(XTAL1/CLKIN)
Unconnected: CAN.1 CAN.4 CAN.8 U1.C6(PMIC_POWER_EN) U1.D3(DDR_A15) U1.M5(VPP) U2.A3(NC) U2.A7(NF/#TDQS) U2.F1(NC) U2.F9(NC) U2.H1(NC) U2.H9(NC) U2.J7(NC) U3.A3(NC) U3.A7(NF/#TDQS) U3.F1(NC) U3.F9(NC) U3.H1(NC) U3.H9(NC) U3.J7(NC) U8.1(NC) U8.2(NC) U8.3(NC) U8.4(NC) U8.5(NC) U8.6(NC) U8.10(NC) U8.11(NC) U8.14(NC) U8.15(NC) U8.20(NC) U8.21(NC) U8.22(NC) U8.23(NC) U8.24(NC) U8.25(NC) U8.26(NC) U8.27(NC) U8.28(NC) U8.33(NC) U8.34(NC) U8.35(NC) U8.38(NC) U8.39(NC) U8.40(NC) U8.45(NC) U8.46(NC) U8.47(NC) U8.48(NC) U10.5(VREF) U22.19(#OVCUR2) U22.20(#PWREN2) U22.22(#PWREN1) VGA_DB15-F1.4 VGA_DB15-F1.9 VGA_DB15-F1.11 VGA_DB15-F1.12 VGA_DB15-F1.15

## Buses
SA[0..14]
DQ[0..15]
BA[0..2],CLK,CLKN,CKE,CASN,RASN,WEN,SDQM[0..3],SDQS[0..3],SDQS0_N,SDQS1_N,SDQS2_N,SDQS3_N,DDR3_RST,DDR3_ODT,SCS0
LCD_D[0..7],LCD_D[8..15],LCD_D[16..23],LCD_HSYNC,LCD_VSYNC,LCD_CLK,LCD_DE
NDQ[0..7],NWE,NALE,NCLE,NCE0,NCE1,NRE,NRB[0..1],NDQS,NWP
JTAG_TDO,JTAG_TDI,JTAG_TMS,JTAG_TCK,JTAG_TRST
ETXD[0..3],ETXEN,ETXCK,ERXD[0..3],ERXDV,ERXCK,ERXERR,EMDC,EMDIO,ECOL,ECRS,EPHY-RST#

## Notes on the sheet
- TEXAS INSTRUMENTS 1-GHz Sitara™ ARM® Cortex®-A8 32‑Bit MPU REV.2023-04
- SİSTEM KONTROL-2023 MURAT IRKAN | 2 x [2Gb DDR3 SDRAM (256Mx8)] = 512MBytes
- DDR3 BELLEK M3-DDR_D0
- Terminations @ pull-ups???? | See TMDSSK3358/ddr3
- RST???
- Ethernet
- LCD EXTENSION | NAND Flash
- 32Gb (4096M x 8bit)
- UEXTs
- 5.0V | GND
- 3.3V | GND
- R0 | R1
- R2 | R3
- R4 | R5
- R6 | R7
- G0 | G1
- G2 | G3
- G4 | G5
- G6 | G7
- B0 | B1
- B2 | B3
- scan????? | B4 | B5
- B6 | B7
- HSYNC | VSYNC
- CLK | DE
- Buttons
- L/R | U/D
- PWRE | BKL
- X1 | X2
- Y1 | Y2
- 24 bits data bus connections are taken from: "TMDSSK3358_3H0009_REV1_2B_SCH_PDF.pdf"(Starter Kit)
- In the "AM335x General Purpose EVM Board Design Files" and related to it
- "ARM MPU AM335x EVM LCD A Board Schematic (Rev 1.1A)" Red and Blue colours are crossed!!!
- "AM335x BeagleBone LCD7 Revision A3" uses 16 bits long data bus, so it can't be used for reference!!!
- "ULCD7-Lite-schematic" uses 24 bits long data bus, but it is related to another microcontroller at all
- -> DM3730, i.e. "DM3730 BeagleBoard-xM_Schematic_REVA3.pdf", so it can't be used for reference as well!!!
- USB 0-1 PORT KONTROL_OK
- USB-HOSTs
- Iset = 6800/R48
- USB 0-1 PORT KONTROL_OK | Iset = 1000mA
- Notes:
- =====
- 1. PWREN1# is the only power-
- enable output for GANG mode;
- 2. OVCUR1# is the only over
- current flag for GANG mode;
- GND-SASE KONTROL OK | GND-SASE | GND-SASE | 3. Gang mode means that power
- management affects whole 4
- ports as a group;
- 4. Individual power management,
- i.e. individual mode is not
- supported on SSOP28 package!
- SİSTEM LED | VGA
- JTAG
- MicroSD-KART
- RTC_PWR:   1.8V/4%/10mA | GPIO EXTENSION
- SİSTEM ANA REGÜLATÖR | VDDS_PWR:  1.8V/4%/50mA | Reset Circuit
- Other:
- CPU_PWR:  1.1V/4%/400mA | MPU_PWR:  1.25V/4%/720mA
- -> 200mS Delay
- Additional tests must be done!
- Rg | Ri
- USB-OTG
- Rh | Rj
- Vout=0.6x(1+Rg/Rh) | Vout=0.6x(1+Ri/Rj)
- PERIPHERAL_PWR:  3.3V/4%/???mA | DDR3_PWR:  1.5V/4%/200mA
- VDDSHV1-6__PWR:  3.3V/4%/350mA
- Iset = 6800/Rs | Rs
- Iset = 523mA
- Rc | Re
- Rd | Rf
- Vout=0.6x(1+Rc/Rd) | Vout=0.6x(1+Re/Rf) | CAN DRIVER
- Ra
- Rb
- Vout=0.923x(1+Ra/Rb)
- 6-16VDC

## Power pins joined to a net without a drawn wire
GND: VGA_DB15-F1.GND1 VGA_DB15-F1.GND2